# EasyEDA Pro project AnalogPIController_20251124_C.eprj

# Schematic Analog PI Controller v7.1
Board Name: Analog PI Controller v7.1; Create Date: 2025-11-23; Page Name: Schematic; Project Name: AnalogPIController_20251123_a; Schematic Name: Analog PI Controller v7.1; Update Date: 2025-11-23; Add into BOM: yes; Company: Derek Stoddard, Swaroop Handral; Convert to PCB: yes; Date: 2025-11-08; Draw By: Derek Stoddard; REV: 6.0; Sheet: 1/1; spicePre: .
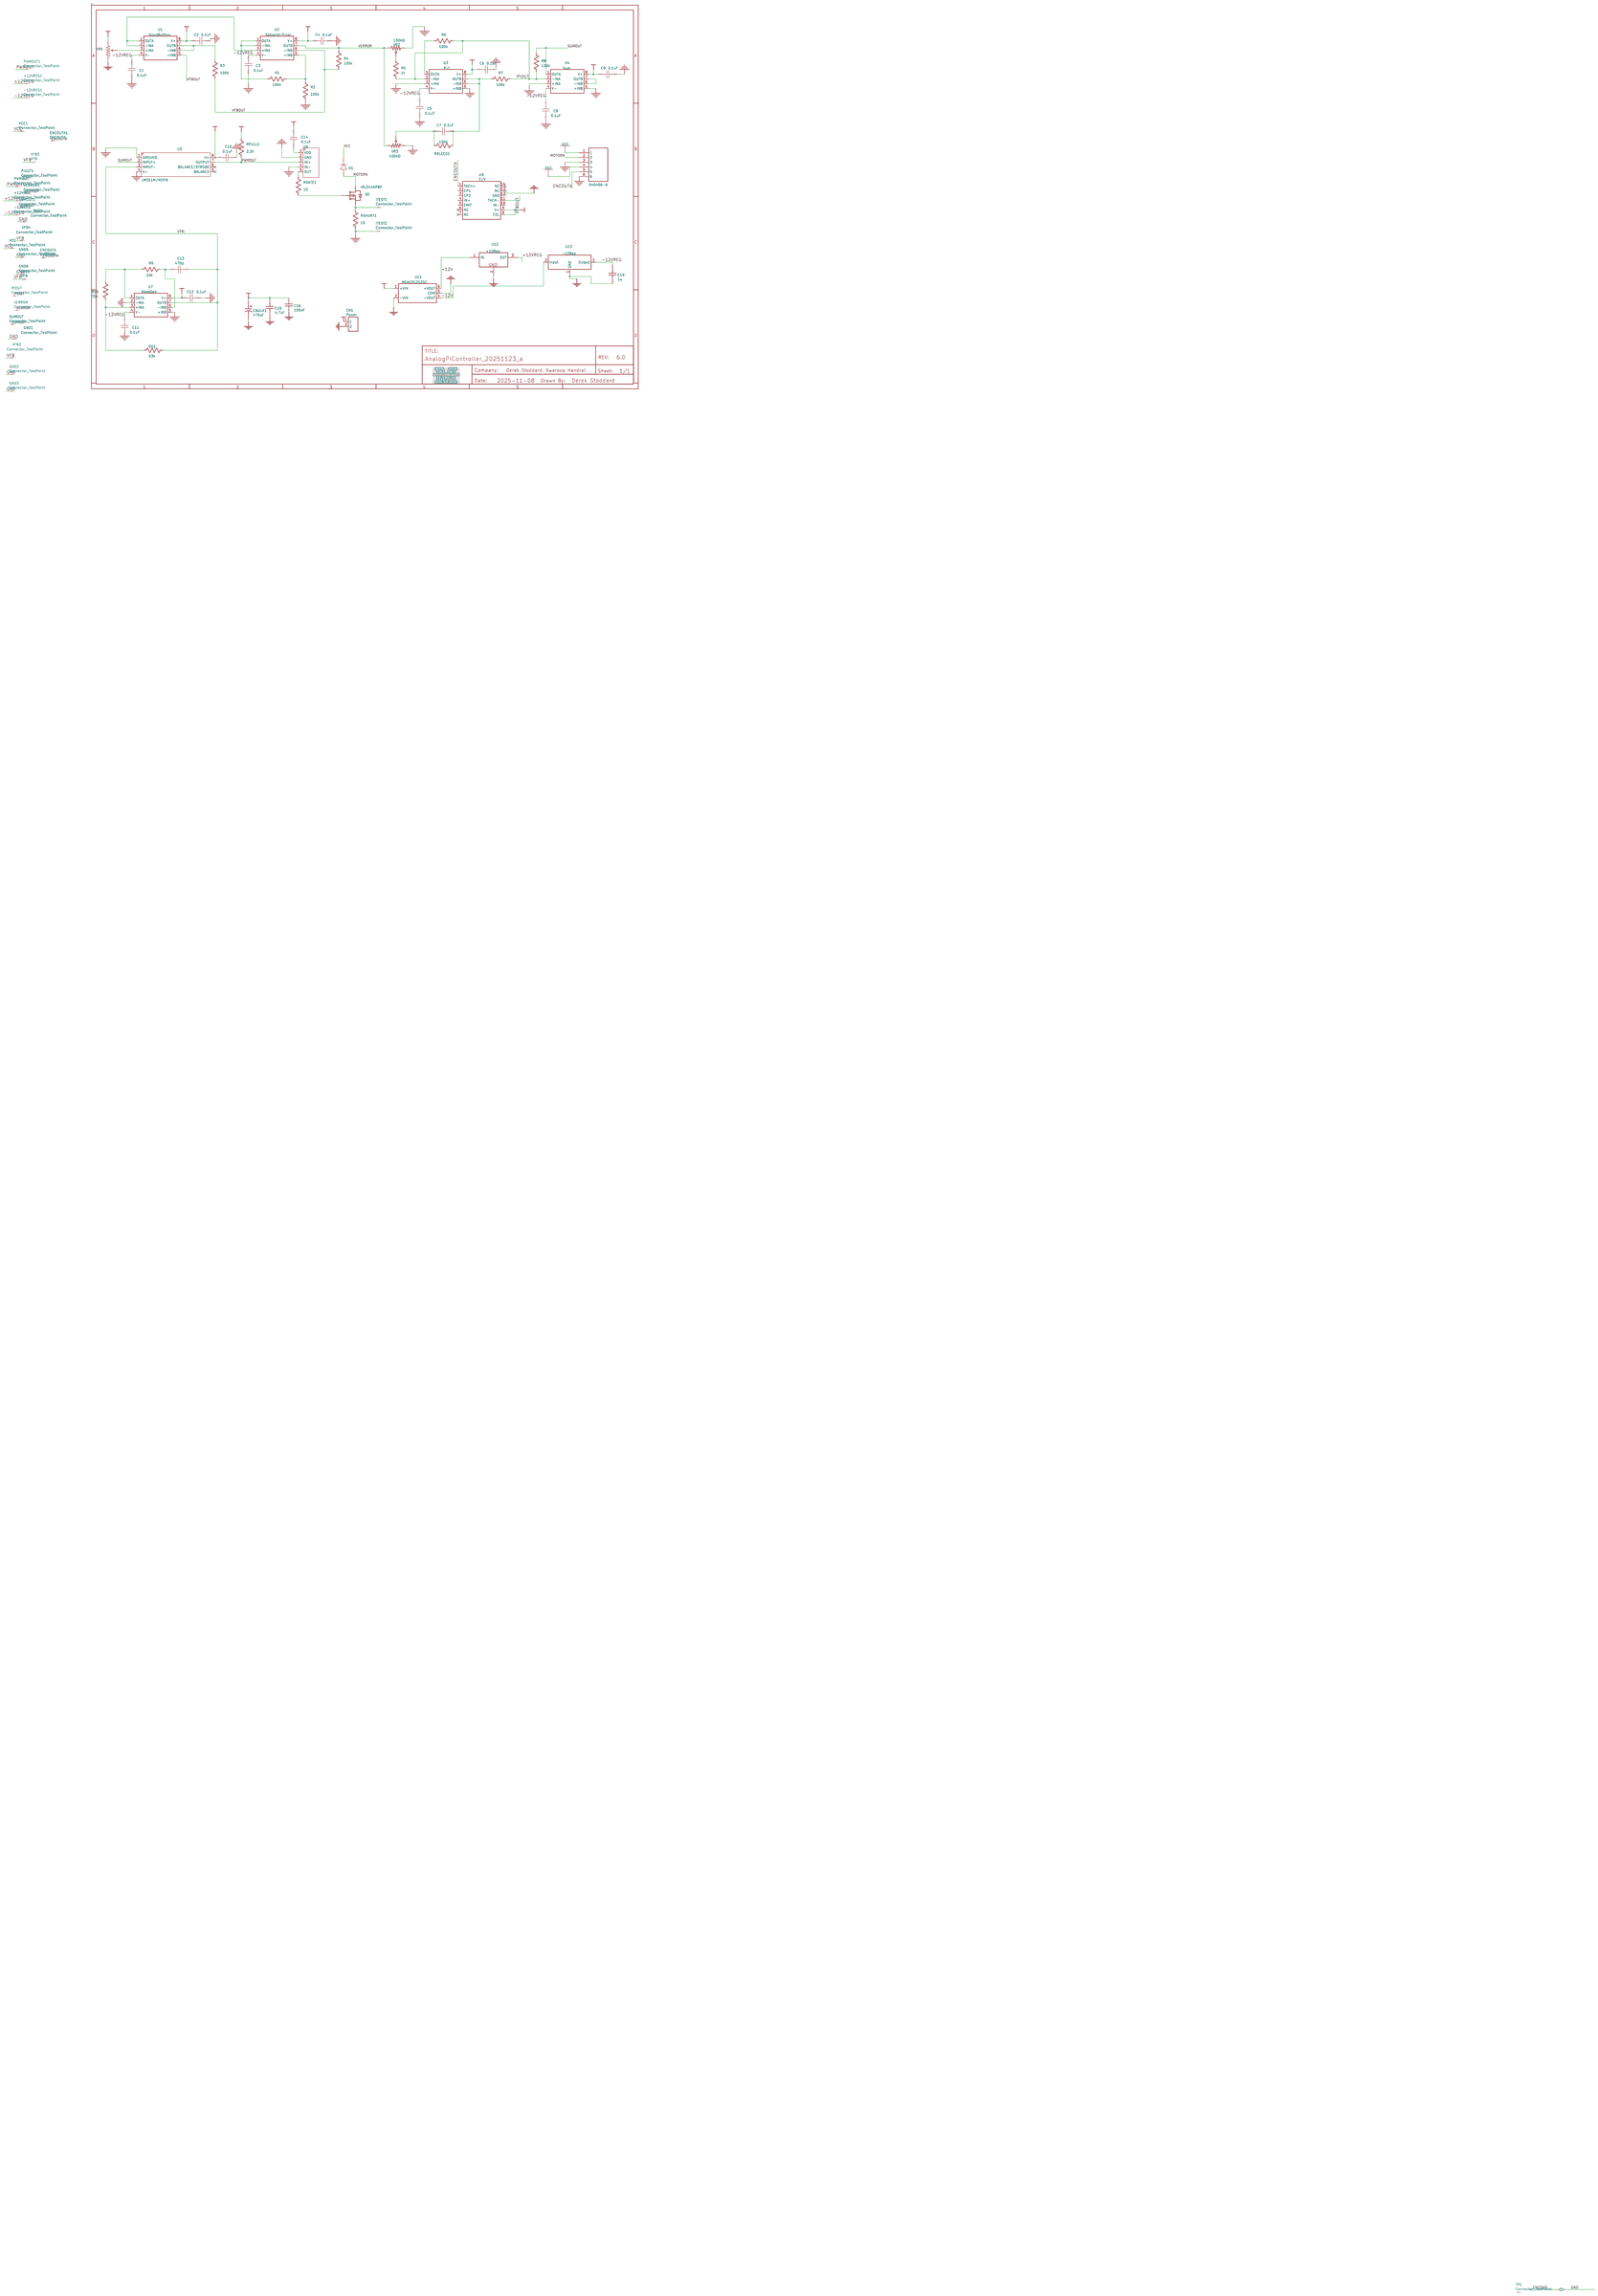
[diagram p0: schematic sheet]

## Parts
+12VREG  Connector_TestPoint  [TESTPOINT:TESTPOINT_PAD_D1.5MM]
+12VREG1  Connector_TestPoint  [TESTPOINT:TESTPOINT_PAD_D1.5MM]
-12VREG  Connector_TestPoint  [TESTPOINT:TESTPOINT_PAD_D1.5MM]
-12VREG1  Connector_TestPoint  [TESTPOINT:TESTPOINT_PAD_D1.5MM]
C1  0.1uF  [C0603]
C2  0.1uF  [C0603]
C3  0.1uF  [C0603]
C4  0.1uF  [C0603]
C5  0.1uF  [C0603]
C6  0.1uF  [C0603]
C7  0.1uF  [C0603]
C8  0.1uF  [C0603]
C9  0.1uF  [C0603]
C10  0.1uF  [C0603]
C11  0.1uF  [C0603]
C12  0.1uF  [C0603]
C13  470p  [C0603]
C14  0.1uF  [C0603]
C15  4.7uF  [C0603]
C16  100nF  [C0603]
C19  1u  [C0603]
CBULK1  470uF  [CAP-SMD_BD10.0-L10.3-W10.3-FD]
CN1  Power  [CONN-TH_2P-P5.00_691137710002]
D1  -  [R-6_BD9.0-L9.0-W9.0-P15.00-D1.7-FD]
ENCOUTA  ENCOUTA  [TESTPOINT:TESTPOINT_PAD_D1.5MM]
ENCOUTA1  ENCOUTA  [TESTPOINT:TESTPOINT_PAD_D1.5MM]
GND1  Connector_TestPoint  [TESTPOINT:TESTPOINT_PAD_D1.5MM]
GND2  Connector_TestPoint  [TESTPOINT:TESTPOINT_PAD_D1.5MM]
GND3  Connector_TestPoint  [TESTPOINT:TESTPOINT_PAD_D1.5MM]
GND4  Connector_TestPoint  [TESTPOINT:TESTPOINT_PAD_D1.5MM]
GND5  Connector_TestPoint  [TESTPOINT:TESTPOINT_PAD_D1.5MM]
GND6  Connector_TestPoint  [TESTPOINT:TESTPOINT_PAD_D1.5MM]
ITEST1  Connector_TestPoint  [TESTPOINT:TESTPOINT_PAD_D1.5MM]
ITEST2  Connector_TestPoint  [TESTPOINT:TESTPOINT_PAD_D1.5MM]
PIOUT  Connector_TestPoint  [TESTPOINT:TESTPOINT_PAD_D1.5MM]
PIOUT1  Connector_TestPoint  [TESTPOINT:TESTPOINT_PAD_D1.5MM]
PWMOUT  Connector_TestPoint  [TESTPOINT:TESTPOINT_PAD_D1.5MM]
PWMOUT1  Connector_TestPoint  [TESTPOINT:TESTPOINT_PAD_D1.5MM]
Q1  IRLZ44NPBF  [TO-220-3_L10.0-W4.5-P2.54-T]
R1  100k  [R0603]
R2  100k  [R0603]
R3  100k  [R0603]
R4  100k  [R0603]
R5  1k  [R0603]
R6  100k  [R0603]
R7  100k  [R0603]
R8  100k  [R0603]
R9  10k  [R0603]
R10  75k  [R0603]
R11  63k  [R0603]
RBLEED1  100k  [R0603]
RGATE1  10  [R0603]
RPULL1  2.2k  [R0603]
RSHUNT1  10  [R0603]
SUMOUT  Connector_TestPoint  [TESTPOINT:TESTPOINT_PAD_D1.5MM]
SUMOUT1  Connector_TestPoint  [TESTPOINT:TESTPOINT_PAD_D1.5MM]
TP1  Connector_TestPoint  [TESTPOINT:TESTPOINT_PAD_D1.5MM]
U1  InputBuffers  [SOIC-8_L4.9-W3.9-P1.27-LS6.0-BL]
U2  Setpoint/Error  [SOIC-8_L4.9-W3.9-P1.27-LS6.0-BL]
U3  P/I  [SOIC-8_L4.9-W3.9-P1.27-LS6.0-BL]
U4  Sum  [SOIC-8_L4.9-W3.9-P1.27-LS6.0-BL]
U5  LM311M/NOPB  [SOIC-8_L4.9-W3.9-P1.27-LS6.0-BL]
U6  -  [SOT-23-5_L3.0-W1.7-P0.95-LS2.8-BR]
U7  WaveGen  [SOIC-8_L4.9-W3.9-P1.27-LS6.0-BL]
U9  F/V  [SOIC-14_L8.7-W3.9-P1.27-LS6.0-BL]
U10  640456-6  [TE_640456-6]
U11  MEA1D1212SC  [PWRM-TH_MEA1DXXXXSC]
U12  +12Reg  [TO-220-3_L10.2-W4.6-P2.54-L]
U13  -12Reg  [TO-220-3_L10.2-W4.6-P2.54-L]
VCC  Connector_TestPoint  [TESTPOINT:TESTPOINT_PAD_D1.5MM]
VCC1  Connector_TestPoint  [TESTPOINT:TESTPOINT_PAD_D1.5MM]
VERROR  Connector_TestPoint  [TESTPOINT:TESTPOINT_PAD_D1.5MM]
VERROR1  Connector_TestPoint  [TESTPOINT:TESTPOINT_PAD_D1.5MM]
VFB1  VFB  [TESTPOINT:TESTPOINT_PAD_D1.5MM]
VFB2  Connector_TestPoint  [TESTPOINT:TESTPOINT_PAD_D1.5MM]
VFB3  VFB  [TESTPOINT:TESTPOINT_PAD_D1.5MM]
VFB4  Connector_TestPoint  [TESTPOINT:TESTPOINT_PAD_D1.5MM]
VR1  RK1631110U2A  [RES-ADJ-TH_RK1631110U2A]
VR2  100kΩ  [RES-ADJ-SMD_L4.8-W3.5-P2.50-BL-1]
VR3  100kΩ  [RES-ADJ-SMD_L4.8-W3.5-P2.50-BL-1]

## Library data of the parts
+12VREG +12VREG1 -12VREG -12VREG1 GND1-GND6 ITEST1 ITEST2 PIOUT PIOUT1 PWMOUT PWMOUT1 SUMOUT SUMOUT1 TP1 VCC VCC1 VERROR VERROR1 VFB2 VFB4 = Connector_TestPoint: Contributor: lolologe; spicePre: T
C1-C14 = CAP_0603: Supplier Footprint: 0603
C15 = 4.7uF: Supplier: LCSC; Supplier Part: C90057; Manufacturer: muRata(村田); Manufacturer Part: GRM188R61E475KE11D; JLCPCB Part Class: Extended Part; nameAlias: Value; Contributor: LCSC; spicePre: C; spiceSymbolName: GRM188R61E475KE11D
C16 = 100nF: Supplier: LCSC; Manufacturer Part: GRM033R61E104KE14D; Manufacturer: muRata(村田); Supplier Part: C76939; JLCPCB Part Class: Extended Part; nameAlias: Value; spicePre: C; spiceSymbolName: GRM033R61E104KE14D
C19 = 1u: nameAlias: Value(F); Contributor: LCEDA_Lib; spicePre: C; spiceSymbolName: C_0603_US
CBULK1 = 470uF: Supplier: LCSC; Supplier Part: C494847; Manufacturer: PANASONIC(松下); Manufacturer Part: EEEFN1V471UP; JLCPCB Part Class: Extended Part; nameAlias: Value; Contributor: lcsc; spicePre: C; spiceSymbolName: EEEFN1V471UP
CN1 = Power: Supplier: LCSC; Supplier Part: C5332011; Manufacturer: Wurth(伍尔特); Manufacturer Part: 691137710002; JLCPCB Part Class: Extended Part; Contributor: lcsc; spicePre: C; spiceSymbolName: 691137710002
D1 = 1N4007: Supplier Footprint: DO-41
ENCOUTA ENCOUTA1 = ENCOUTA: Contributor: lolologe; spicePre: T; spiceSymbolName: Connector_TestPoint
Q1 = IRLZ44NPBF: Supplier: LCSC; Manufacturer: Infineon(英飞凌); Supplier Part: C38774; JLCPCB Part Class: Extended Part; spicePre: Q
R1-R11 RBLEED1 RGATE1 RPULL1 RSHUNT1 = 1k: nameAlias: Value(Ω); Contributor: LCEDA_Lib; spicePre: R; spiceSymbolName: R_0603_US
U1-U4 = Buff/Err: Supplier: LCSC; Supplier Part: C1347222; Manufacturer: TI(德州仪器); Manufacturer Part: OPA2197ID; JLCPCB Part Class: Extended Part; Contributor: LCSC; spicePre: U; spiceSymbolName: OPA2197ID; Package Display: No
U5 = LM311M/NOPB: Input Offset Voltage (Vos):7.5mV Input Bias Current (Ib):250nA Input Hysteresis Voltage (Vhys):- Common Mode Rejection Ratio (CMRR):- Supply Voltage:5V~36V；2.5V~18V Supply Voltage:5V~36V；2.5V~18V Output Type:Open set；Open shoot Output Mode:MOS；RTL；DTL；TTL; Supplier Part: C352842; Manufacturer: TI(德州仪器); Supplier Footprint: SOIC-8; JLCPCB Part Class: Extended Part; Datasheet: https://www.ti.com/cn/lit/gpn/lm311-n; Supplier: LCSC; Input Offset Voltage (Vos): 7.5mV; Input Bias Current (Ib): 250nA; Supply Voltage: 5V~36V；2.5V~18V; Output Type: Open set；Open shoot; Output Mode: MOS；RTL；DTL；TTL; Operating Temperature: 0℃~+70℃
U6 = UCC27517DBVR: Supplier Part: C99395; Manufacturer: TI(德州仪器); Supplier Footprint: SOT-23-5; JLCPCB Part Class: Extended Part; Datasheet: https://atta.szlcsc.com/upload/public/pdf/source/20170518/1495086077196.pdf; Supplier: LCSC
U7 = WaveGen: Supplier: LCSC; Supplier Part: C1347222; Manufacturer: TI(德州仪器); Manufacturer Part: OPA2197ID; JLCPCB Part Class: Extended Part; Contributor: LCSC; spicePre: U; spiceSymbolName: OPA2197ID
U9 = F/V: Supplier: LCSC; Supplier Part: C914112; Manufacturer: TI(德州仪器); Manufacturer Part: LM2917MX/NOPB; JLCPCB Part Class: Extended Part; Contributor: lcsc; spicePre: U; spiceSymbolName: LM2917MX/NOPB
U10 = 640456-6
U11 = MEA1D1212SC: Supplier: LCSC; Supplier Part: C5382235; Manufacturer: YLPTEC(易川); Contributor: lcsc; spicePre: U
U12 = +12Reg: Supplier: LCSC; Supplier Part: C2872599; Manufacturer: TI(德州仪器); Manufacturer Part: LM7812CT/NOPB; JLCPCB Part Class: Extended Part; Contributor: lcsc; spicePre: U; spiceSymbolName: LM7812CT/NOPB
U13 = -12Reg: Supplier: LCSC; Supplier Part: C10116; Manufacturer: TI(德州仪器); Manufacturer Part: LM7912CT/NOPB; JLCPCB Part Class: Extended Part; Contributor: lcsc; spicePre: U; spiceSymbolName: LM7912CT/NOPB
VFB1 VFB3 = VFB: Contributor: lolologe; spicePre: T; spiceSymbolName: Connector_TestPoint
VR1 = RK1631110U2A: LCSC Part Name: RK1631110U2A 三件套; Supplier Part: C3007973; Manufacturer: ALPSALPINE(阿尔卑斯阿尔派); Supplier Footprint: 插件; Datasheet: https://atta.szlcsc.com/upload/public/pdf/source/20220811/DF006DA1C1FC1909BE18ADD0BBA20DF6.pdf; Supplier: LCSC
VR2 VR3 = 100kΩ: Supplier: LCSC; Supplier Part: C7328709; Manufacturer: BOURNS; Manufacturer Part: PVG5A104C03R00; JLCPCB Part Class: Extended Part; nameAlias: Value; Contributor: lcsc; spicePre: R; spiceSymbolName: PVG5A104C03R00

## Nets
+12V: U11.6(+VOUT) U12.1(IN)
+12VREG: +12VREG.1 +12VREG1.1 C2.1 C4.1 C6.1 C9.1 C10.1 C12.1 C14.2 RPULL1.1 U1.8(V+) U2.8(V+) U3.8(V+) U4.8(V+) U5.8(V+) U7.8(V+) U9.8(COL) U9.9(V+) U12.3(OUT) VR1.3
-12V: U11.4(-VOUT) U13.2(Input)
-12VREG: -12VREG.1 -12VREG1.1 C1.1 C3.1 C5.1 C8.1 C11.1 C19.2 U1.4(V-) U2.4(V-) U3.4(V-) U4.4(V-) U7.4(V-) U13.3(Output)
GND: C1.2 C2.2 C3.2 C4.2 C5.2 C6.2 C8.2 C9.2 C10.2 C11.2 C12.2 C15.1 C16.1 C19.1 CBULK1.2 CN1.2 GND1.1 GND2.1 GND3.1 GND4.1 GND5.1 GND6.1 ITEST2.1 R2.2 RSHUNT1.2 U3.3(+INA) U3.5(+INB) U4.3(+INA) U4.5(+INB) U5.1(GROUND) U5.4(V-) U6.2(GND) U6.4(IN-) U7.2(-INA) U7.5(+INB) U9.12(GND) U10.3 U10.6 U11.2(-VIN) U11.5(COM) U12.2(GND) U13.1(GND) VR1.1 VR2.3 VR3.3
VCC: C15.2 C16.2 CBULK1.1 CN1.1 D1.1(K) U10.1 U10.4 U11.1(+VIN) VCC.1 VCC1.1
ENCOUTA: ENCOUTA.1 ENCOUTA1.1 U9.1(TACH+) U10.5
MOTORN: D1.2(A) Q1.2(D) U10.2
PIOUT: PIOUT.1 PIOUT1.1 R5.2 R6.1 R7.1 R8.2 U3.2(-INA) U4.2(-INA)
PWMOUT: PWMOUT.1 PWMOUT1.1 RPULL1.2 U5.7(OUTPUT) U6.3(IN+)
SUMOUT: R8.1 SUMOUT.1 SUMOUT1.1 U4.1(OUTA) U5.2(INPUT+)
VERROR: R4.1 U2.7(OUTB) VERROR.1 VERROR1.1 VR2.1 VR3.1
VFB: VFB1.1 VFB2.1 VFB3.1 VFB4.1
VFBOUT: R3.2 R4.2 U1.5(+INB) U2.6(-INB) U9.11(TACH-)
VTRI: C13.2 R11.1 U5.3(INPUT-) U7.7(OUTB)
Net-(C7-1): C7.1 RBLEED1.2 VR3.2
Net-(C7-2): C7.2 R7.2 RBLEED1.1 U3.6(-INB) U3.7(OUTB)
Net-(C13-1): C13.1 R9.1 U7.6(-INB)
Net-(C14-1): C14.1 U6.1(VDD)
Net-(ITEST1-1): ITEST1.1 Q1.3(S) RSHUNT1.1
Net-(Q1-1): Q1.1(G) RGATE1.2
Net-(R1-1): R1.1 R2.1 U2.5(+INB)
Net-(R1-2): R1.2 U2.1(OUTA) U2.2(-INA)
Net-(R3-1): R3.1 U1.6(-INB) U1.7(OUTB)
Net-(R5-1): R5.1 VR2.2
Net-(R6-2): R6.2 U3.1(OUTA)
Net-(R9-2): R9.2 R10.1 U7.1(OUTA)
Net-(R10-2): R10.2 R11.2 U7.3(+INA)
Net-(RGATE1-1): RGATE1.1 U6.5(OUT)
Net-(U1-1): U1.1(OUTA) U1.2(-INA) U2.3(+INA)
Net-(U1-3): U1.3(+INA) VR1.2
Net-(U4-6): U4.6(-INB) U4.7(OUTB)

Not connected (* = marked no-connect by the designer): TP1 1; U5 5(BALANCE)* 6(BALANCE/STROBE)*; U9 2(CP1) 3(CP2) 4(IN+) 5(EMIT) 6(NC)* 7(NC)* 10(IN-) 13(NC)* 14(NC)*

# Schematic PIControllerv7.5
Board Name: PCB2; Create Date: 2025-11-24; Page Name: Sch_PIControllerv7.5; Project Name: AnalogPIController_20251124_C; Schematic Name: PIControllerv7.5; Update Date: 2025-11-24; Company: University of Maine; Drawn: Derek Stoddard; Page Size: A4; Version: V7.5
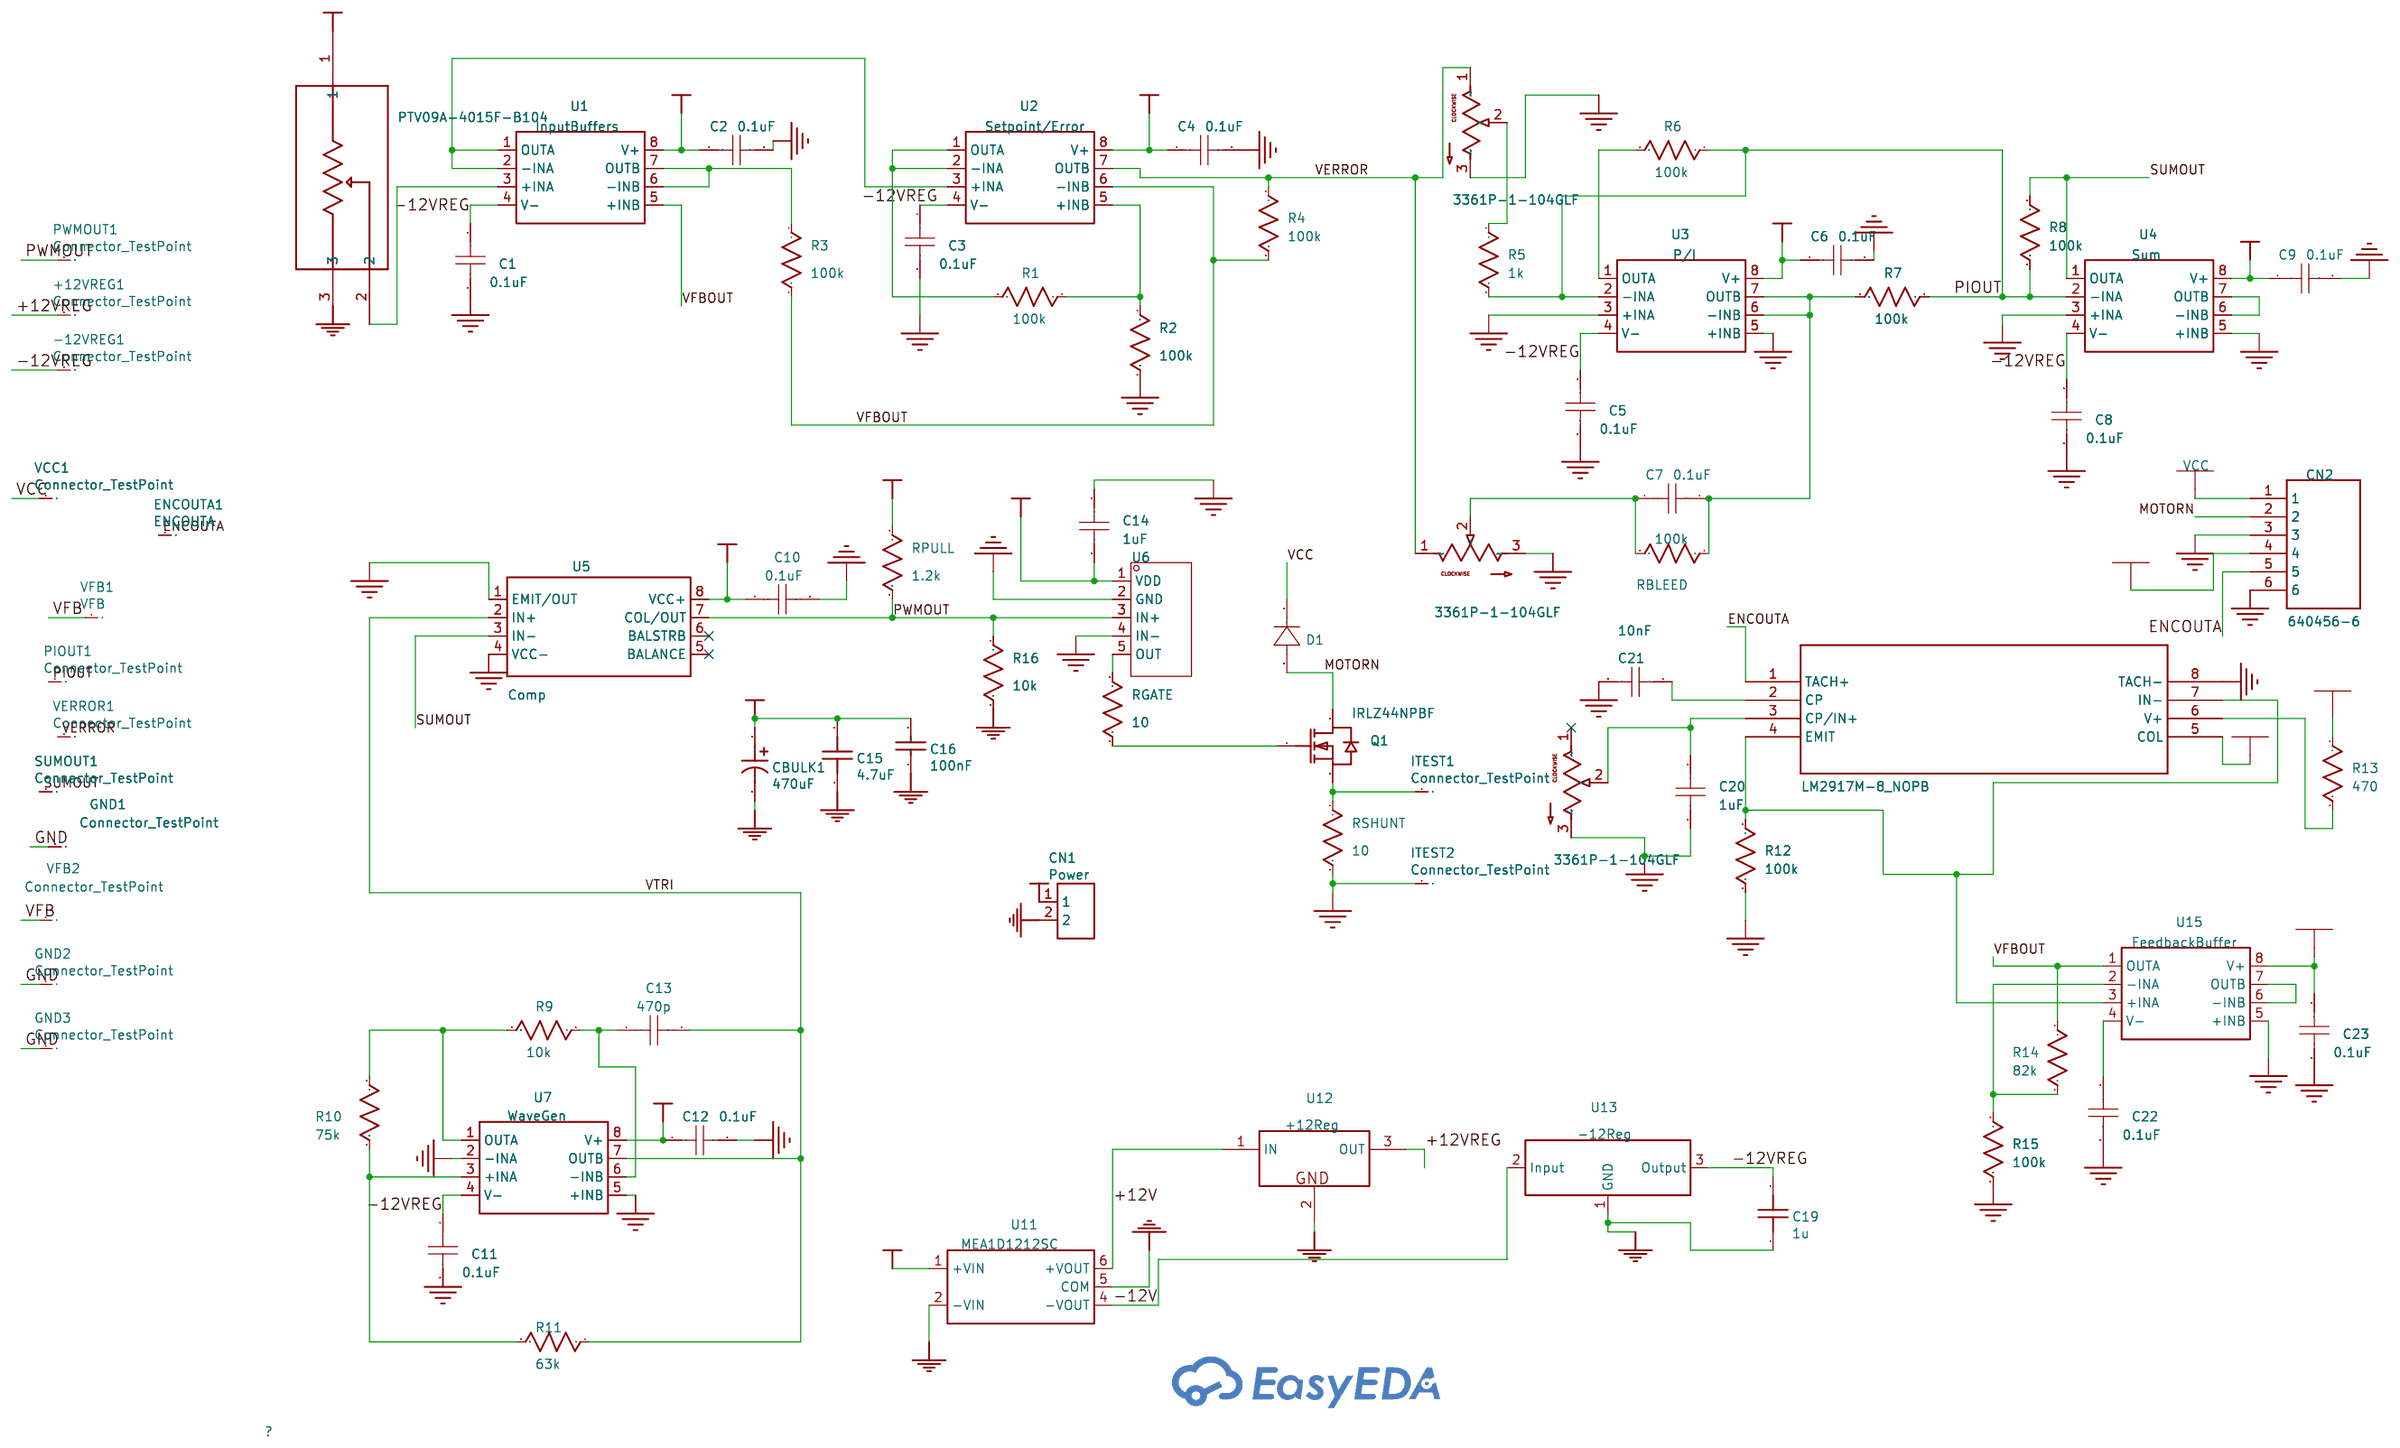
[diagram p1: schematic sheet]

## Parts
+12VREG1  Connector_TestPoint  [TESTPOINT:TESTPOINT_PAD_D1.5MM]
-12VREG1  Connector_TestPoint  [TESTPOINT:TESTPOINT_PAD_D1.5MM]
C1  0.1uF  [C0603]
C2  0.1uF  [C0603]
C3  0.1uF  [C0603]
C4  0.1uF  [C0603]
C5  0.1uF  [C0603]
C6  0.1uF  [C0603]
C7  0.1uF  [C0603]
C8  0.1uF  [C0603]
C9  0.1uF  [C0603]
C10  0.1uF  [C0603]
C11  0.1uF  [C0603]
C12  0.1uF  [C0603]
C13  470p  [C0603]
C14  1uF  [C0603]
C15  4.7uF  [C0603]
C16  100nF  [C0603]
C19  1u  [C0603]
C20  1uF  [C0603]
C21  10nF  [C0603]
C22  0.1uF  [C0603]
C23  0.1uF  [C0603]
CBULK1  470uF  [CAP-SMD_BD10.0-L10.3-W10.3-FD]
CN1  Power  [CONN-TH_2P-P5.00_691137710002]
CN2  640456-6  [TE_640456-6]
D1  -  [R-6_BD9.0-L9.0-W9.0-P15.00-D1.7-FD]
ENCOUTA1  ENCOUTA  [TESTPOINT:TESTPOINT_PAD_D1.5MM]
GND1  Connector_TestPoint  [TESTPOINT:TESTPOINT_PAD_D1.5MM]
GND2  Connector_TestPoint  [TESTPOINT:TESTPOINT_PAD_D1.5MM]
GND3  Connector_TestPoint  [TESTPOINT:TESTPOINT_PAD_D1.5MM]
ITEST1  Connector_TestPoint  [TESTPOINT:TESTPOINT_PAD_D1.5MM]
ITEST2  Connector_TestPoint  [TESTPOINT:TESTPOINT_PAD_D1.5MM]
PIOUT1  Connector_TestPoint  [TESTPOINT:TESTPOINT_PAD_D1.5MM]
PWMOUT1  Connector_TestPoint  [TESTPOINT:TESTPOINT_PAD_D1.5MM]
Q1  IRLZ44NPBF  [TO-220-3_L10.0-W4.5-P2.54-T]
R1  100k  [R0603]
R2  100k  [R0603]
R3  100k  [R0603]
R4  100k  [R0603]
R5  1k  [R0603]
R6  100k  [R0603]
R7  100k  [R0603]
R8  100k  [R0603]
R9  10k  [R0603]
R10  75k  [R0603]
R11  63k  [R0603]
R12  100k  [R0603]
R13  470  [R0603]
R14  82k  [R0603]
R15  100k  [R0603]
R16  10k  [R0603]
RBLEED  100k  [R0603]
RGATE  10  [R0603]
RPULL  1.2k  [R0603]
RSHUNT  10  [R0603]
SUMOUT1  Connector_TestPoint  [TESTPOINT:TESTPOINT_PAD_D1.5MM]
U1  InputBuffers  [SOIC-8_L4.9-W3.9-P1.27-LS6.0-BL]
U2  Setpoint/Error  [SOIC-8_L4.9-W3.9-P1.27-LS6.0-BL]
U3  P/I  [SOIC-8_L4.9-W3.9-P1.27-LS6.0-BL]
U4  Sum  [SOIC-8_L4.9-W3.9-P1.27-LS6.0-BL]
U5  Comp  [SOIC-8_L5.0-W4.0-P1.27-LS6.0-BL]
U6  -  [SOT-23-5_L3.0-W1.7-P0.95-LS2.8-BR]
U7  WaveGen  [SOIC-8_L4.9-W3.9-P1.27-LS6.0-BL]
U11  MEA1D1212SC  [PWRM-TH_MEA1DXXXXSC]
U12  +12Reg  [TO-220-3_L10.2-W4.6-P2.54-L]
U13  -12Reg  [TO-220-3_L10.2-W4.6-P2.54-L]
U14  LM2917M-8_NOPB  [M08A_TEX]
U15  FeedbackBuffer  [SOIC-8_L4.9-W3.9-P1.27-LS6.0-BL]
VCC1  Connector_TestPoint  [TESTPOINT:TESTPOINT_PAD_D1.5MM]
VERROR1  Connector_TestPoint  [TESTPOINT:TESTPOINT_PAD_D1.5MM]
VFB1  VFB  [TESTPOINT:TESTPOINT_PAD_D1.5MM]
VFB2  Connector_TestPoint  [TESTPOINT:TESTPOINT_PAD_D1.5MM]
VR1  PTV09A-4015F-B104  [PTV09A-4015F-B104_BRN]
VR2  3361P-1-104GLF  [TRIM_3361P-1-104GLF]
VR3  3361P-1-104GLF  [TRIM_3361P-1-104GLF]
VR4  3361P-1-104GLF  [TRIM_3361P-1-104GLF]

## Library data of the parts
+12VREG1 -12VREG1 GND1-GND3 ITEST1 ITEST2 PIOUT1 PWMOUT1 SUMOUT1 VCC1 VERROR1 VFB2 = Connector_TestPoint: Contributor: lolologe; spicePre: T
C1-C14 C20-C23 = CAP_0603: Supplier Footprint: 0603
C15 = 4.7uF: Supplier: LCSC; Supplier Part: C90057; Manufacturer: muRata(村田); Manufacturer Part: GRM188R61E475KE11D; JLCPCB Part Class: Extended Part; nameAlias: Value; Contributor: LCSC; spicePre: C; spiceSymbolName: GRM188R61E475KE11D
C16 = 100nF: Supplier: LCSC; Manufacturer Part: GRM033R61E104KE14D; Manufacturer: muRata(村田); Supplier Part: C76939; JLCPCB Part Class: Extended Part; nameAlias: Value; spicePre: C; spiceSymbolName: GRM033R61E104KE14D
C19 = 1u: nameAlias: Value(F); Contributor: LCEDA_Lib; spicePre: C; spiceSymbolName: C_0603_US
CBULK1 = 470uF: Supplier: LCSC; Supplier Part: C494847; Manufacturer: PANASONIC(松下); Manufacturer Part: EEEFN1V471UP; JLCPCB Part Class: Extended Part; nameAlias: Value; Contributor: lcsc; spicePre: C; spiceSymbolName: EEEFN1V471UP
CN1 = Power: Supplier: LCSC; Supplier Part: C5332011; Manufacturer: Wurth(伍尔特); Manufacturer Part: 691137710002; JLCPCB Part Class: Extended Part; Contributor: lcsc; spicePre: C; spiceSymbolName: 691137710002
CN2 = 640456-6
D1 = 1N4007: Supplier Footprint: DO-41
ENCOUTA1 = ENCOUTA: Contributor: lolologe; spicePre: T; spiceSymbolName: Connector_TestPoint
Q1 = IRLZ44NPBF: Supplier: LCSC; Manufacturer: Infineon(英飞凌); Supplier Part: C38774; JLCPCB Part Class: Extended Part; spicePre: Q
R1-R16 RBLEED RGATE RPULL RSHUNT = 1k: nameAlias: Value(Ω); Contributor: LCEDA_Lib; spicePre: R; spiceSymbolName: R_0603_US
U1-U4 U15 = Buff/Err: Supplier: LCSC; Supplier Part: C1347222; Manufacturer: TI(德州仪器); Manufacturer Part: OPA2197ID; JLCPCB Part Class: Extended Part; Contributor: LCSC; spicePre: U; spiceSymbolName: OPA2197ID; Package Display: No
U5 = Comp: Supplier: LCSC; Manufacturer: TI(德州仪器); Manufacturer Part: LM311DR; Supplier Part: C12597; JLCPCB Part Class: Extended Part
U6 = UCC27517DBVR: Supplier Part: C99395; Manufacturer: TI(德州仪器); Supplier Footprint: SOT-23-5; JLCPCB Part Class: Extended Part; Datasheet: https://atta.szlcsc.com/upload/public/pdf/source/20170518/1495086077196.pdf; Supplier: LCSC
U7 = WaveGen: Supplier: LCSC; Supplier Part: C1347222; Manufacturer: TI(德州仪器); Manufacturer Part: OPA2197ID; JLCPCB Part Class: Extended Part; Contributor: LCSC; spicePre: U; spiceSymbolName: OPA2197ID
U11 = MEA1D1212SC: Supplier: LCSC; Supplier Part: C5382235; Manufacturer: YLPTEC(易川); Contributor: lcsc; spicePre: U
U12 = +12Reg: Supplier: LCSC; Supplier Part: C2872599; Manufacturer: TI(德州仪器); Manufacturer Part: LM7812CT/NOPB; JLCPCB Part Class: Extended Part; Contributor: lcsc; spicePre: U; spiceSymbolName: LM7812CT/NOPB
U13 = -12Reg: Supplier: LCSC; Supplier Part: C10116; Manufacturer: TI(德州仪器); Manufacturer Part: LM7912CT/NOPB; JLCPCB Part Class: Extended Part; Contributor: lcsc; spicePre: U; spiceSymbolName: LM7912CT/NOPB
U14 = LM2917M-8_NOPB
VFB1 = VFB: Contributor: lolologe; spicePre: T; spiceSymbolName: Connector_TestPoint
VR1 = PTV09A-4015F-B104
VR2-VR4 = 3361P-1-104GLF

## Nets
+12V: U11.6(+VOUT) U12.1(IN)
+12VREG: +12VREG1.1 C2.1 C4.1 C6.1 C9.1 C10.1 C12.1 C14.1 C23.1 R13.1 RPULL.1 U1.8(V+) U2.8(V+) U3.8(V+) U4.8(V+) U5.8(VCC+) U6.1(VDD) U7.8(V+) U12.3(OUT) U14.5(COL) U15.8(V+) VR1.1
-12V: U11.4(-VOUT) U13.2(Input)
-12VREG: -12VREG1.1 C1.1 C3.1 C5.1 C8.1 C11.1 C19.2 U1.4(V-) U2.4(V-) U3.4(V-) U4.4(V-) U7.4(V-) U13.3(Output)
GND: C1.2 C2.2 C3.2 C4.2 C5.2 C6.2 C8.2 C9.2 C10.2 C11.2 C12.2 C14.2 C15.1 C16.1 C19.1 C20.2 C21.2 C22.2 C23.2 CBULK1.2 CN1.2 CN2.3 CN2.6 GND1.1 GND2.1 GND3.1 ITEST2.1 R2.2 R12.2 R15.2 R16.2 RSHUNT.2 U3.3(+INA) U3.5(+INB) U4.3(+INA) U4.5(+INB) U5.1(EMIT/OUT) U5.4(VCC-) U6.2(GND) U6.4(IN-) U7.2(-INA) U7.5(+INB) U11.2(-VIN) U11.5(COM) U12.2(GND) U13.1(GND) U14.8(TACH-) U15.5(+INB) VR1.3 VR2.3 VR3.3 VR4.3
VCC: C15.2 C16.2 CBULK1.1 CN1.1 CN2.1 CN2.4 D1.1(K) U11.1(+VIN) VCC1.1
ENCOUTA: CN2.5 ENCOUTA1.1 U14.1(TACH+)
MOTORN: CN2.2 D1.2(A) Q1.2(D)
PIOUT: PIOUT1.1 R5.2 R6.1 R7.1 R8.2 U3.2(-INA) U4.2(-INA)
PWMOUT: PWMOUT1.1 R16.1 RPULL.2 U5.7(COL/OUT) U6.3(IN+)
SUMOUT: R8.1 SUMOUT1.1 U4.1(OUTA) U5.3(IN-)
VERROR: R4.1 U2.7(OUTB) VERROR1.1 VR2.1 VR3.1
VFB: VFB1.1 VFB2.1
VFBOUT: R3.2 R4.2 R14.1 U1.5(+INB) U2.6(-INB) U15.1(OUTA)
VTRI: C13.2 R11.1 U5.2(IN+) U7.7(OUTB)
$1N167: U1.3(+INA) VR1.2
$1N171: U1.1(OUTA) U1.2(-INA) U2.3(+INA)
$1N384: R3.1 U1.6(-INB) U1.7(OUTB)
$1N456: R1.2 U2.1(OUTA) U2.2(-INA)
$1N582: R1.1 R2.1 U2.5(+INB)
$1N1238: R6.2 U3.1(OUTA)
$1N1340: C7.2 R7.2 RBLEED.1 U3.6(-INB) U3.7(OUTB)
$1N1453: C7.1 RBLEED.2 VR3.2
$1N1990: U4.6(-INB) U4.7(OUTB)
$1N2500: R9.2 R10.1 U7.1(OUTA)
$1N2518: R10.2 R11.2 U7.3(+INA)
$1N2538: C13.1 R9.1 U7.6(-INB)
$1N2753: RGATE.1 U6.5(OUT)
$1N2757: Q1.1(G) RGATE.2
$1N8807: ITEST1.1 Q1.3(S) RSHUNT.1
$1N11755: C21.1 U14.2(CP)
$1N11930: C20.1 U14.3(CP/IN+) VR4.2
$1N12022: R12.1 U14.4(EMIT) U14.7(IN-) U15.3(+INA)
$1N12302: R13.2 U14.6(V+)
$1N12460: R14.2 R15.1 U15.2(-INA)
$1N13733: C22.1 U15.4(V-)
$1N13815: U15.6(-INB) U15.7(OUTB)
$1N14002: R5.1 VR2.2

Not connected (* = marked no-connect by the designer): U5 5(BALANCE)* 6(BALSTRB)*; VR4 1*

# Board PCB_PCB_Analog-PI-Controller-v7.1_2025-11-15
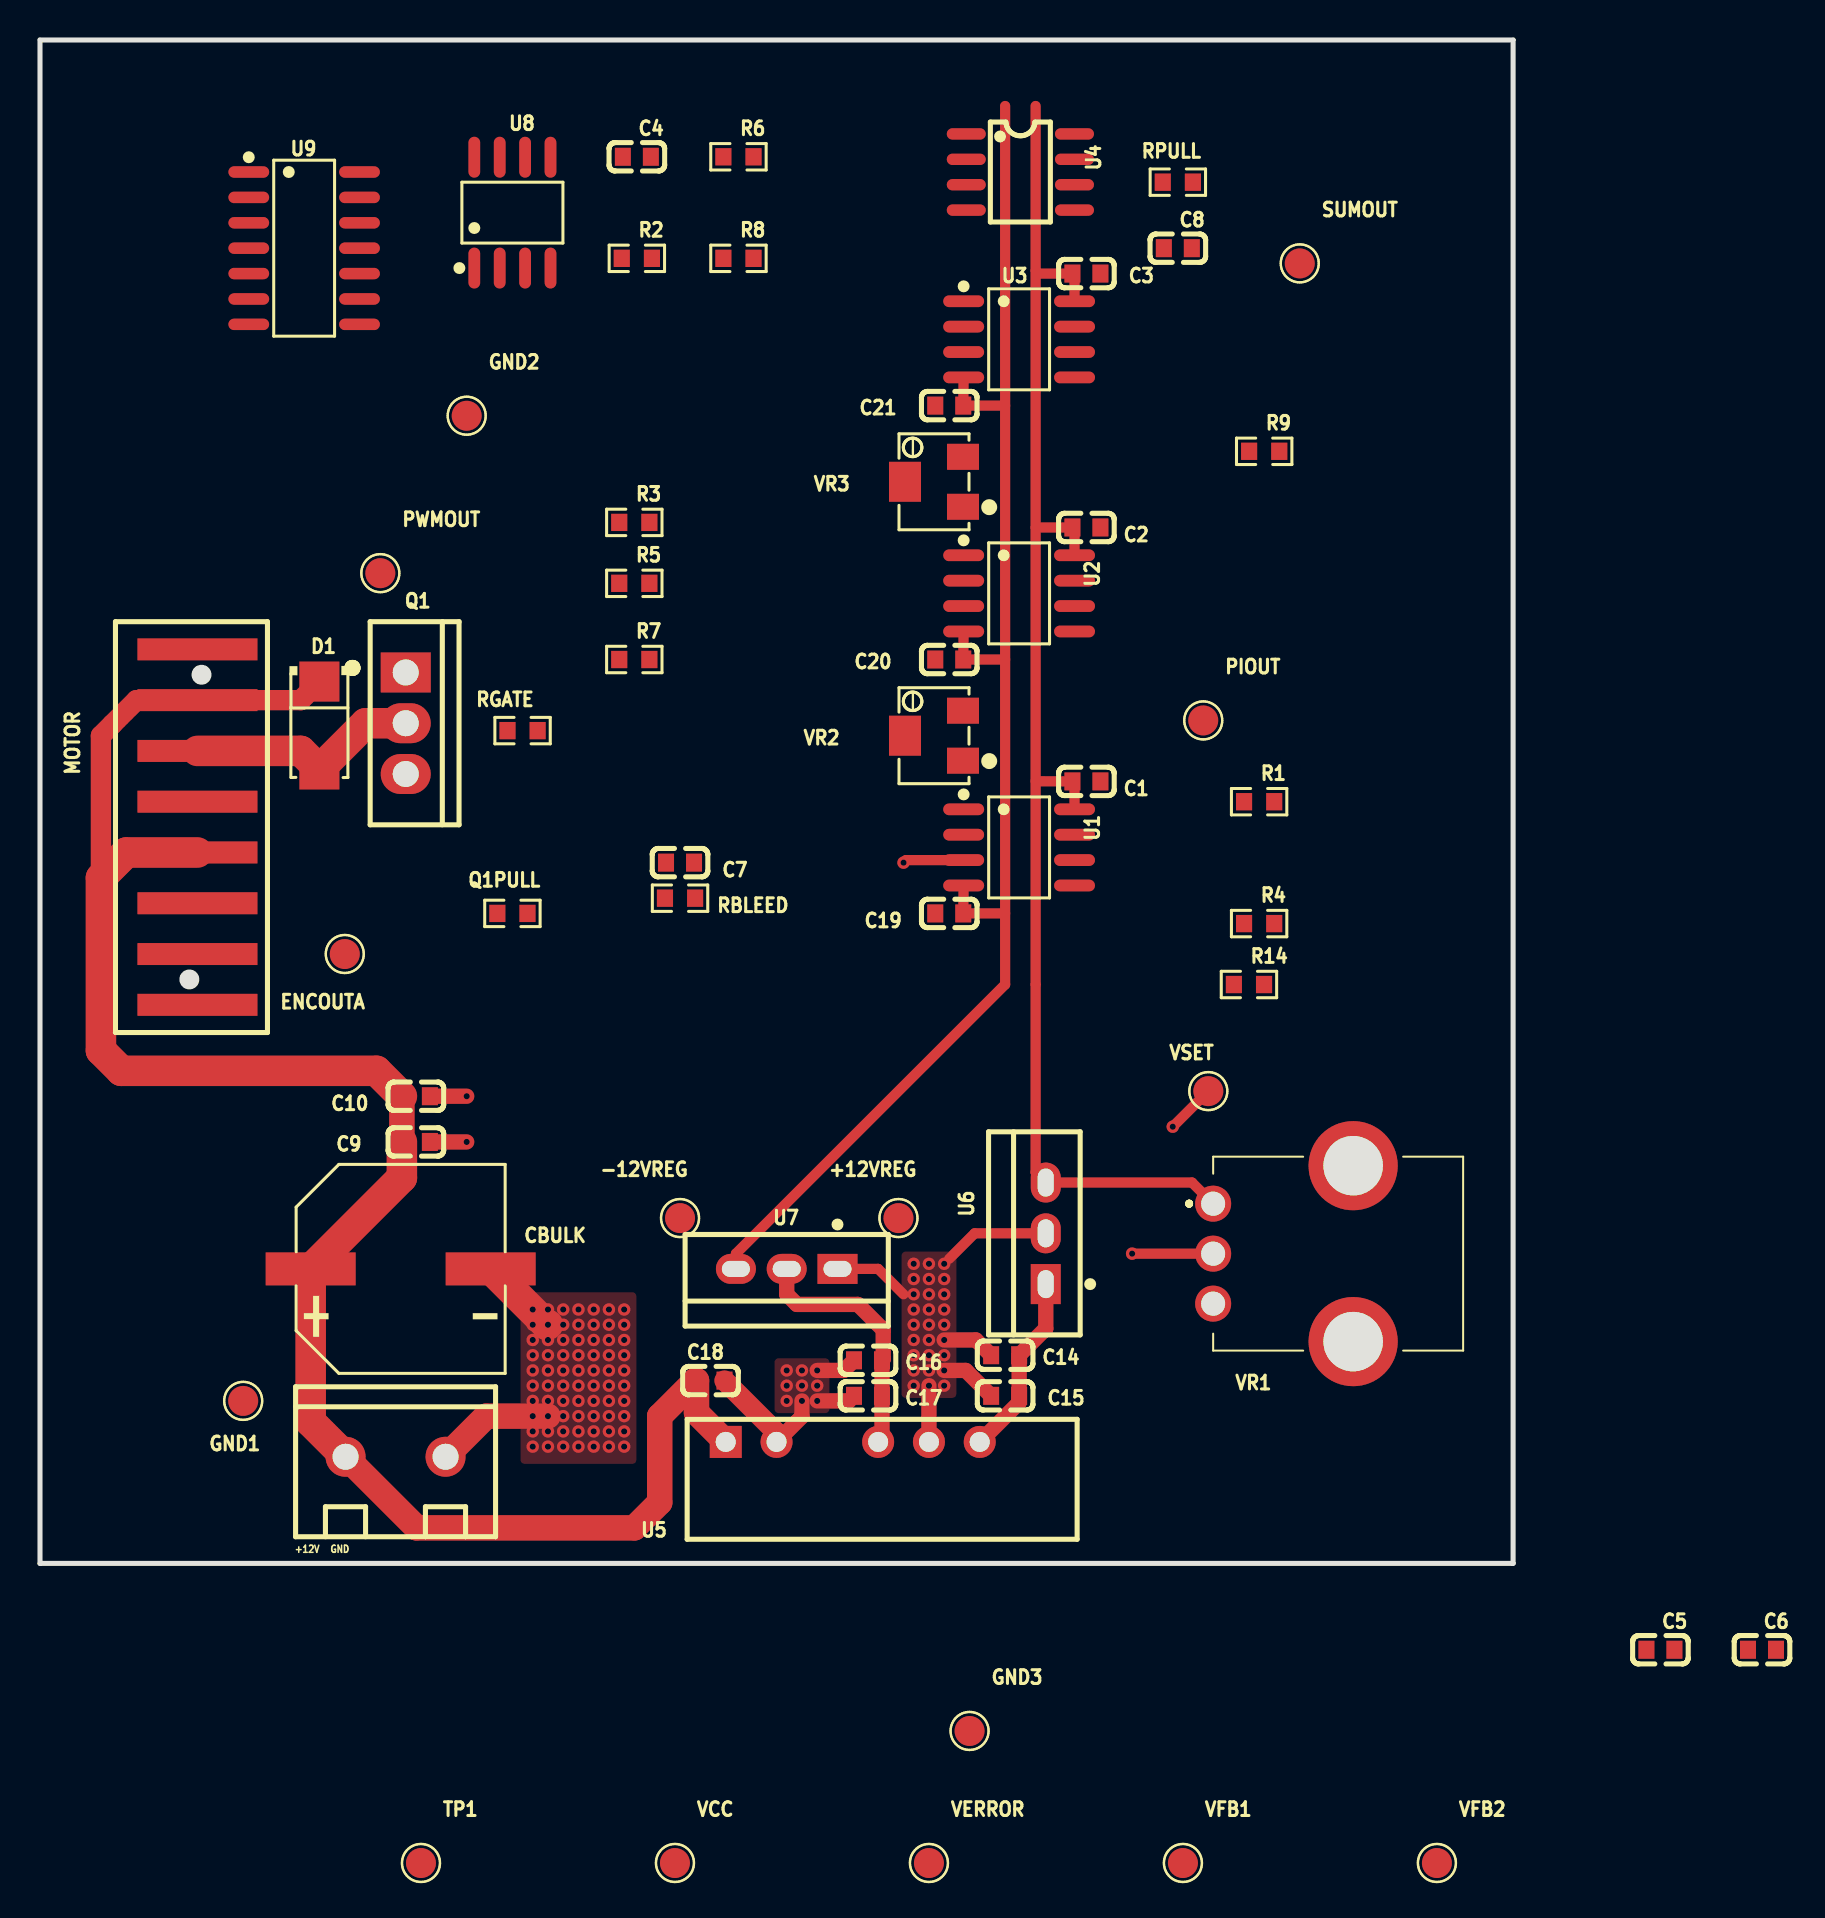
[diagram p2: board, top side]
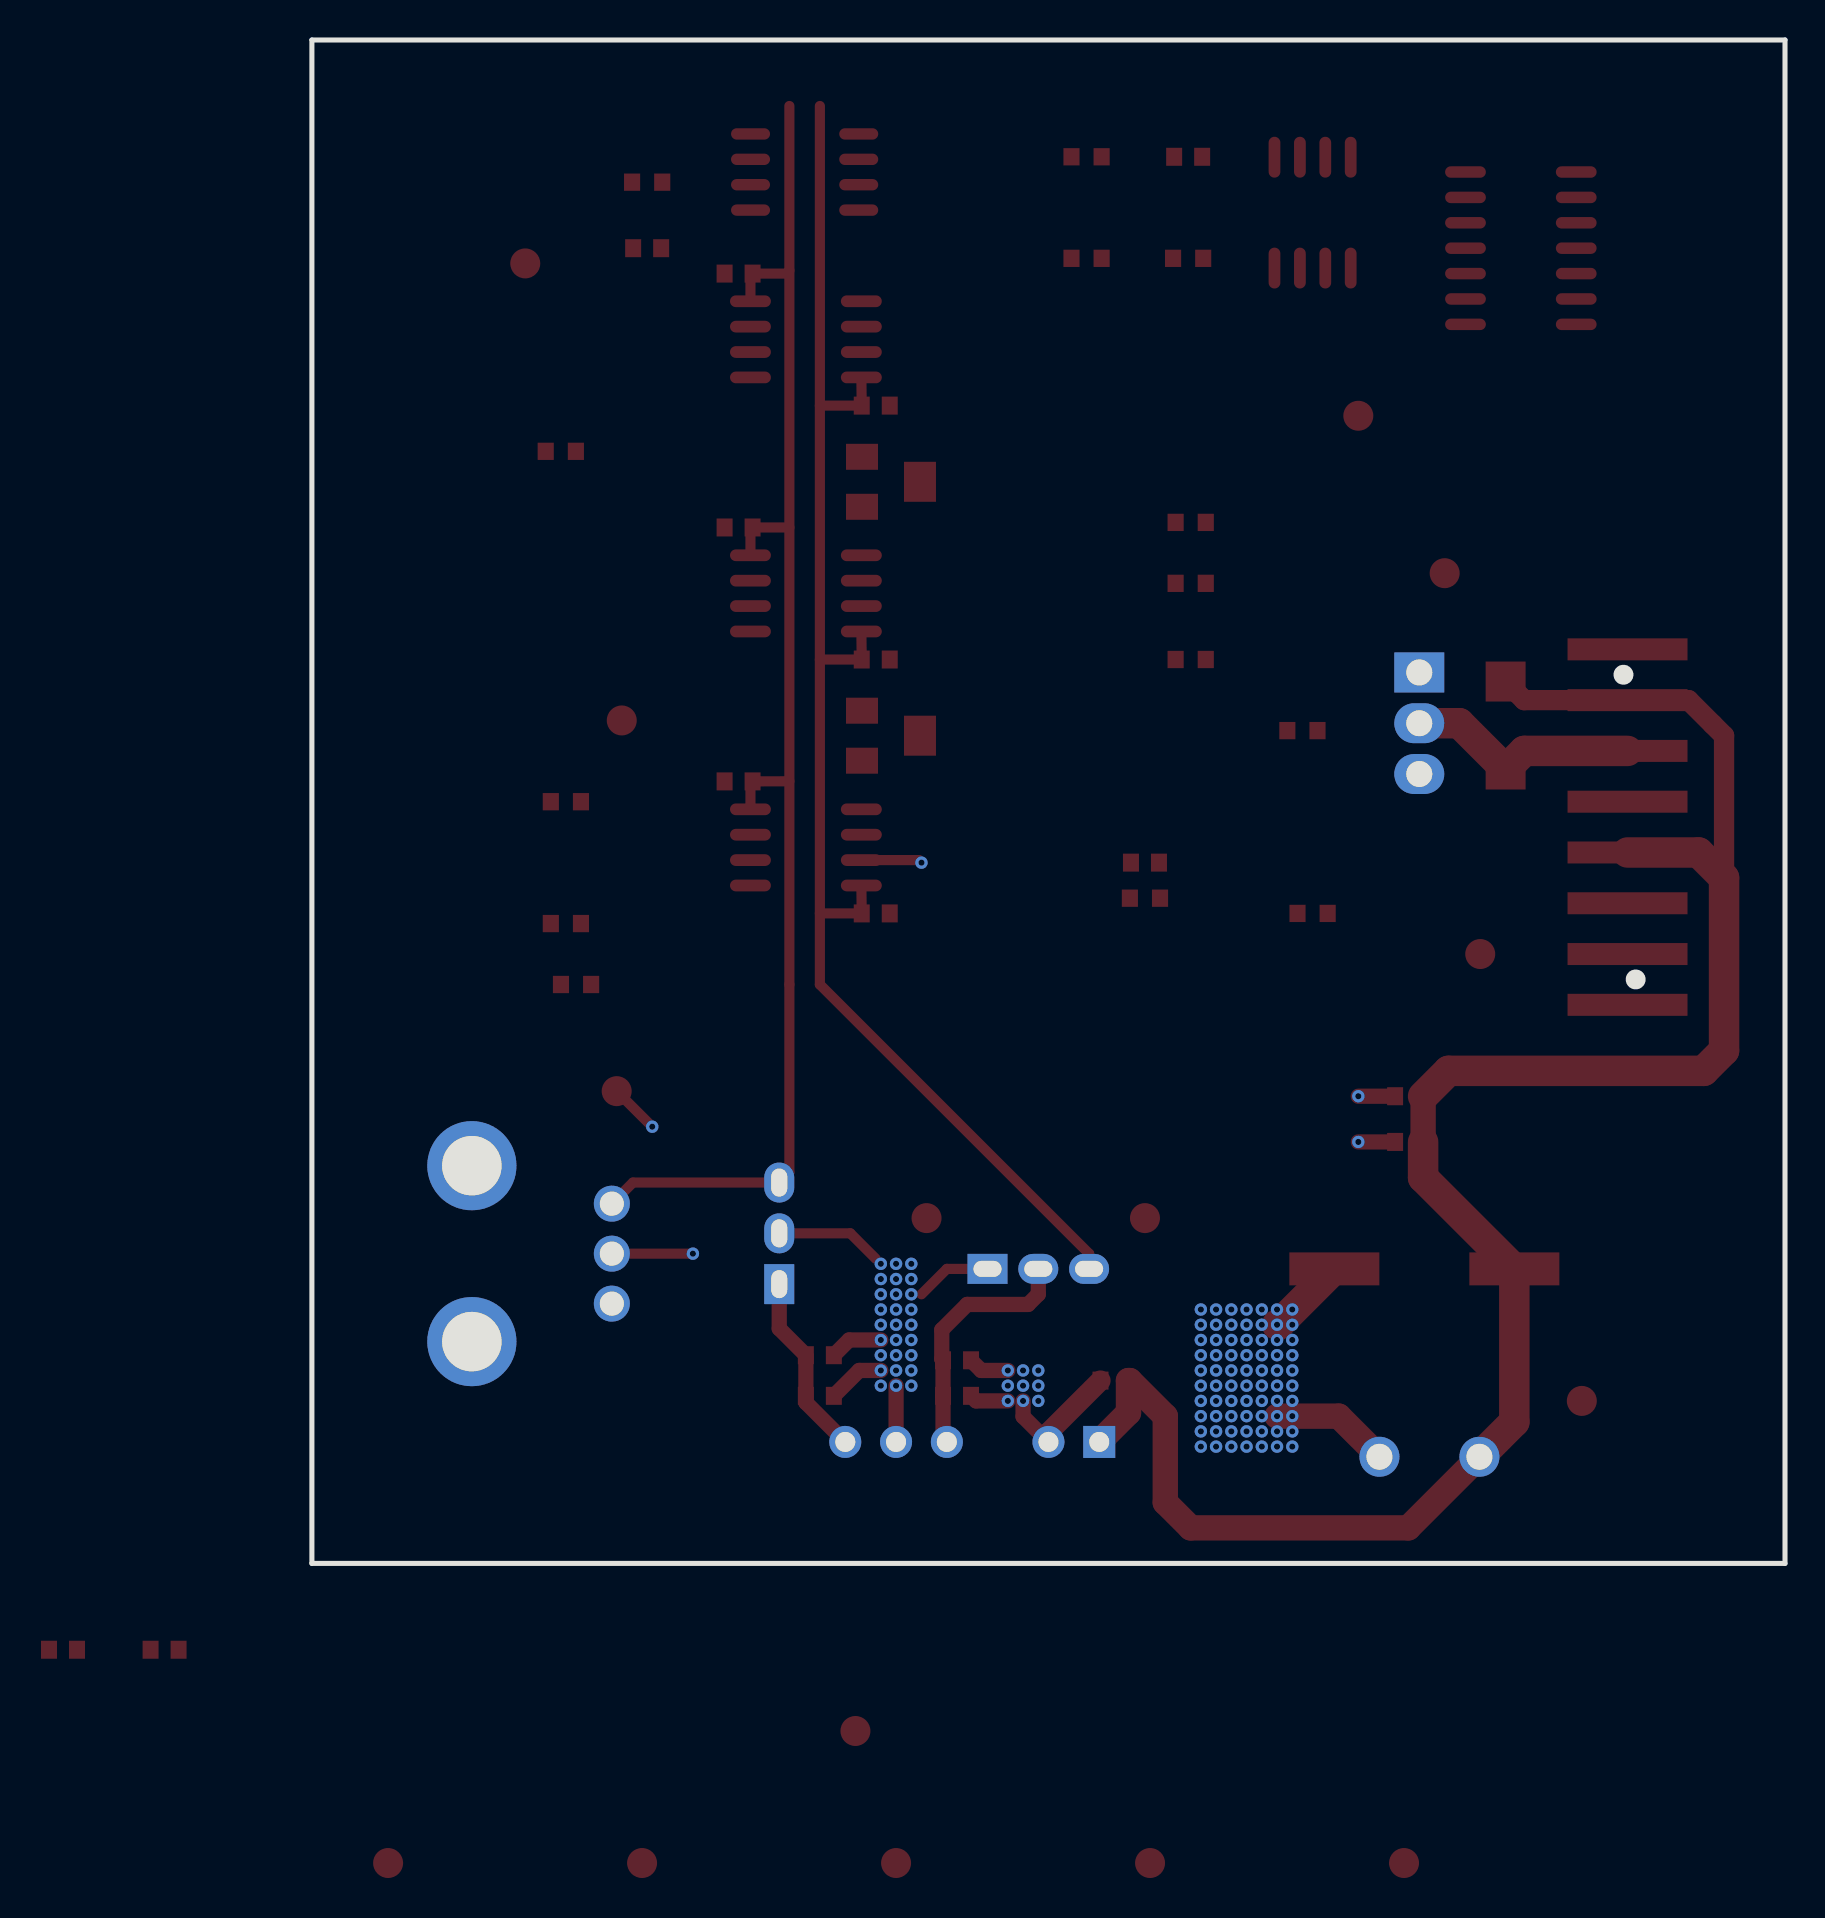
[diagram p3: board, bottom side, seen from below]

Outline 73.66 x 76.2 mm; copper layers: Top Layer, Inner1, Inner2, Bottom Layer. Coordinates in mm from the lower left corner of the outline.
Outline path: 0,76.2 73.66,76.2 73.66,0 0,0 0,76.2
Stack: Top Layer 0.035mm / Dielectric1 0.48mm PP er 4.5 / Inner1 0.035mm / Dielectric2 0.48mm FR4 er 4.5 / Inner2 0.035mm / Dielectric3 0.48mm PP er 4.5 / Bottom Layer 0.035mm

## Design rules (mm)
spacing Default (default): track to track 0.152, other pairs 0 to 0.152
track width Default (default): min 0.254, default 0.254, max 25.4
differential pair differentialPair (default): width min 0.127, default 0.254, max 2.54; gap min 0.152, default 0.152
via Default (default): diameter min 0.61, default 0.61, max 100.025; hole min 0.305, default 0.305, max 59.995
pour e9 uses gge8964
pour e11 uses gge12270
pour e107 uses gge12592
pour e109 uses gge15217
pour e111 uses gge15667

## Placement (name value [footprint] x y rotation side)
+12VREG  Connector_TestPoint  [TESTPOINT:TESTPOINT_PAD_D1.5MM]  42.93 17.27 0 top
-12VREG  Connector_TestPoint  [TESTPOINT:TESTPOINT_PAD_D1.5MM]  32 17.27 0 top
C1  0.1uF  [C0603]  52.32 39.12 0 top
C2  0.1uF  [C0603]  52.32 51.82 0 top
C3  0.1uF  [C0603]  52.32 64.52 0 top
C4  0.1uF  [C0603]  29.84 70.36 0 top
C5  0.1uF  [C0603]  81.03 -4.32 0 top
C6  0.1uF  [C0603]  86.11 -4.32 0 top
C7  0.1uF  [C0603]  32 35.05 0 top
C8  0.1uF  [C0603]  56.9 65.79 0 top
C9  0.1uF  [C0603]  18.8 21.08 180 top
C10  0.1uF  [C0603]  18.8 23.37 180 top
C14  0.1uF  [C0603]  48.26 10.41 0 top
C15  4.7uF  [C0603]  48.26 8.38 0 top
C16  100nF  [C0603]  41.4 10.16 0 top
C17  0.1u  [C0603]  41.4 8.38 0 top
C18  0.1u  [C0603]  33.53 9.14 180 top
C19  1u  [C0603]  45.47 32.51 0 top
C20  0.1u  [C0603]  45.47 45.21 0 top
C21  0.1u  [C0603]  45.47 57.91 0 top
CBULK  470uF  [CAP-SMD_BD10.0-L10.3-W10.3-FD]  18.03 14.73 0 top
CN1  Power  [CONN-TH_2P-P5.00_691137710002]  17.78 5.33 0 top
D1  SK36A  [SMA_L4.3-W2.6-LS5.2-RD]  13.97 41.91 270 top
ENCOUTA  ENCOUTA  [TESTPOINT:TESTPOINT_PAD_D1.5MM]  15.24 30.48 0 top
GND1  Connector_TestPoint  [TESTPOINT:TESTPOINT_PAD_D1.5MM]  10.16 8.13 0 top
GND2  Connector_TestPoint  [TESTPOINT:TESTPOINT_PAD_D1.5MM]  21.34 57.4 0 top
GND3  Connector_TestPoint  [TESTPOINT:TESTPOINT_PAD_D1.5MM]  46.48 -8.38 0 top
MOTOR  MotorConn  [CONN-SMD_6P-P2.54_14110613002000]  7.87 36.83 270 top
PIOUT  Connector_TestPoint  [TESTPOINT:TESTPOINT_PAD_D1.5MM]  58.17 42.16 0 top
PWMOUT  Connector_TestPoint  [TESTPOINT:TESTPOINT_PAD_D1.5MM]  17.02 49.53 0 top
Q1  IRLZ44NPBF  [TO-220-3_L10.0-W4.5-P2.54-T]  18.29 42.03 0 top
Q1PULL  100k  [R0603]  23.62 32.51 0 top
R1  100k  [R0603]  60.96 38.1 0 top
R2  100k  [R0603]  29.84 65.28 0 top
R3  100k  [R0603]  29.72 52.07 0 top
R4  100k  [R0603]  60.96 32 0 top
R5  1k  [R0603]  29.72 49.02 0 top
R6  100k  [R0603]  34.92 70.36 0 top
R7  100k  [R0603]  29.72 45.21 0 top
R8  100k  [R0603]  34.92 65.28 0 top
R9  10k  [R0603]  61.21 55.63 0 top
R14  1k  [R0603]  60.45 28.96 0 top
RBLEED  1k  [R0603]  32 33.27 0 top
RGATE  100  [R0603]  24.13 41.66 0 top
RPULL  20k  [R0603]  56.9 69.09 0 top
SUMOUT  Connector_TestPoint  [TESTPOINT:TESTPOINT_PAD_D1.5MM]  62.99 65.02 0 top
TP1  Connector_TestPoint  [TESTPOINT:TESTPOINT_PAD_D1.5MM]  19.05 -14.99 0 top
U1  InputBuffers  [SOIC-8_L4.9-W3.9-P1.27-LS6.0-BL]  48.96 35.81 270 top
U2  Setpoint/Error  [SOIC-8_L4.9-W3.9-P1.27-LS6.0-BL]  48.96 48.52 270 top
U3  P/I  [SOIC-8_L4.9-W3.9-P1.27-LS6.0-BL]  48.96 61.23 270 top
U4  Sum  [SOIC-8_L5.0-W4.0-P1.27-LS6.0-BL]  49.02 69.6 270 top
U5  LM311M/NOPB  [PWRM-TH_MEA1DXXXXSC]  40.64 6.08 0 top
U6  +12Reg  [TO-220-3_L10.2-W4.6-P2.54-L]  50.29 16.51 90 top
U7  WaveGen  [TO-220-3_L10.2-W4.6-P2.54-L]  37.34 14.73 180 top
U8  WaveGen  [SOIC-8_L4.9-W3.9-P1.27-LS6.0-BL]  23.62 67.56 0 top
U9  F/V  [SOIC-14_L8.7-W3.9-P1.27-LS6.0-BL]  13.21 65.79 270 top
VCC  Connector_TestPoint  [TESTPOINT:TESTPOINT_PAD_D1.5MM]  31.75 -14.99 0 top
VERROR  Connector_TestPoint  [TESTPOINT:TESTPOINT_PAD_D1.5MM]  44.45 -14.99 0 top
VFB1  VFB  [TESTPOINT:TESTPOINT_PAD_D1.5MM]  57.15 -14.99 0 top
VFB2  Connector_TestPoint  [TESTPOINT:TESTPOINT_PAD_D1.5MM]  69.85 -14.99 0 top
VR1  RK1631110U2A  [PTV09A4020FB103]  64.26 15.49 270 top
VR2  100kΩ  [RES-ADJ-SMD_L4.8-W3.5-P2.50-BL-1]  44.7 41.4 90 top
VR3  100kΩ  [RES-ADJ-SMD_L4.8-W3.5-P2.50-BL-1]  44.7 54.1 90 top
VSET  Vset  [TESTPOINT:TESTPOINT_PAD_D1.5MM]  58.42 23.62 0 top

## Footprints (pads in the part's own frame, mm; a bottom-side part is the same pattern mirrored in y, then rotated)
C0603
  rect 0.8x0.9 smd: 1(-0.7,0) 2(0.7,0)
CAP-SMD_BD10.0-L10.3-W10.3-FD
  rect 4.5x1.65 smd: 1(-4.5,0) 2(4.5,0)
CONN-SMD_6P-P2.54_14110613002000
  rect 1.1x6 smd: 1(-6.35,0) 2(-3.81,0) 3(-1.27,0) 4(1.27,0) 5(3.81,0) 6(6.35,0) 7(8.89,0) 8(-8.89,0)
CONN-TH_2P-P5.00_691137710002
  round 2 hole 1.3: 1(-2.5,0) 2(2.5,0)
PTV09A4020FB103
  round 1.8 hole 1.205x1.2: 1(-2.5,-5.6) 2(0,-5.6) 3(2.5,-5.6)
  round 4.46 hole 2.974: 4(-4.4,1.4) 5(4.4,1.4)
PWRM-TH_MEA1DXXXXSC
  rect 1.6x1.6 hole 1: 1(-6.35,0)
  round 1.6 hole 1: 2(-3.81,0) 4(1.27,0) 5(3.81,0) 6(6.35,0)
R0603
  rect 0.806x0.864 smd: 1(-0.753,0) 2(0.753,0)
RES-ADJ-SMD_L4.8-W3.5-P2.50-BL-1
  rect 1.3x1.6 smd: 1(-1.25,-1.45) 3(1.25,-1.45)
  rect 2x1.6 smd: 2(0,1.45)
SMA_L4.3-W2.6-LS5.2-RD
  rect 2x2 smd: 1(-2.2,0) 2(2.2,0)
SOIC-8_L4.9-W3.9-P1.27-LS6.0-BL
  oval 0.588x2.045 smd: 1(-1.905,-2.772) 2(-0.635,-2.772) 3(0.635,-2.772) 4(1.905,-2.772) 5(1.905,2.772) 6(0.635,2.772) 7(-0.635,2.772) 8(-1.905,2.772)
SOIC-8_L5.0-W4.0-P1.27-LS6.0-BL
  oval 0.569x1.95 smd: 1(-1.905,-2.705) 2(-0.635,-2.705) 3(0.635,-2.705) 4(1.905,-2.705) 5(1.905,2.705) 6(0.635,2.705) 7(-0.635,2.705) 8(-1.905,2.705)
SOIC-14_L8.7-W3.9-P1.27-LS6.0-BL
  oval 0.574x2.038 smd: 1(-3.81,-2.769) 2(-2.54,-2.769) 3(-1.27,-2.769) 4(0,-2.769) 5(1.27,-2.769) 6(2.54,-2.769) 7(3.81,-2.769) 8(3.81,2.769) 9(2.54,2.769) 10(1.27,2.769) 11(0,2.769) 12(-1.27,2.769) 13(-2.54,2.769) 14(-3.81,2.769)
TESTPOINT:TESTPOINT_PAD_D1.5MM
  round 1.5 smd: 1(0,0)
TO-220-3_L10.0-W4.5-P2.54-T
  rect 2.5x2 hole 1.3: 1(0,2.54)
  oval 2.5x2 hole 1.3: 2(0,0) 3(0,-2.54)
TO-220-3_L10.2-W4.6-P2.54-L
  rect 2x1.5 hole 1.4x0.8: 1(-2.54,0)
  oval 2x1.5 hole 1.4x0.8: 2(0,0) 3(2.54,0)

## Nets
+12V: C14.2 C15.2 U5.6 U6.1
+12VREG: +12VREG.1 C1.1 C2.1 C3.1 C5.2 C8.1 RPULL.1 U1.8 U2.8 U3.8 U4.8 U6.3 U8.8 U9.8 U9.9 VR1.1
-12V: C16.2 C17.2 U5.4 U7.2
-12VREG: -12VREG.1 C6.2 C19.2 C20.2 C21.2 U1.4 U2.4 U3.4 U7.3 U8.4
GND: C1.2 C2.2 C3.2 C5.1 C6.1 C8.2 C9.1 C10.1 C14.1 C15.1 C16.1 C17.1 C18.1 C19.1 C20.1 C21.1 CBULK.2 CN1.2 GND1.1 GND2.1 GND3.1 MOTOR.3 MOTOR.6 Q1PULL.2 U2.3 U2.5 U3.3 U3.5 U4.1 U4.4 U5.2 U5.5 U6.2 U7.1 U8.2 U8.5 U9.12 VR1.3
VCC: C9.2 C10.2 C18.2 CBULK.1 CN1.1 D1.1 MOTOR.1 MOTOR.4 U5.1 VCC.1
C7_2: C7.2 RBLEED.1 VR3.3
ENCOUTA: ENCOUTA.1 MOTOR.5 U9.1
GATE: Q1.1 Q1.3 Q1PULL.1 RGATE.2
MOTORN: D1.2 MOTOR.2 Q1.2
PIOUT: PIOUT.1 R3.1 R7.2 R9.2 U3.6
PWMOUT: PWMOUT.1 RGATE.1 RPULL.2 U4.7
R2_2: R2.2 R6.2
R5_2: R5.2 VR2.3
SUMOUT: R9.1 SUMOUT.1 U3.7 U4.2
TP1_1: TP1.1
U1_1: R4.1 U1.1 U1.2
U1_3: U1.3 VR1.2 VSET.1
U1_5: R4.2 U1.5
U1_6: R1.1 R14.2 U1.6
U2_1: R3.2 R5.1 U2.1
U2_2: U2.2 VR2.2
U2_6: U2.6 VR3.2
U2_7: C7.1 R7.1 RBLEED.2 U2.7
U8_1: R2.1 R8.2 U8.1
U8_3: U8.3
U8_6: C4.1 R8.1 U8.6
U8_7: C4.2 R6.1 U8.7
U9_2: U9.2
U9_3: U9.3
U9_4: U9.4
U9_5: U9.5
U9_10: U9.10
VERROR: R1.2 U1.7 VERROR.1 VR2.1 VR3.1
VFB: R14.1 U9.11 VFB1.1 VFB2.1
VTRI: U4.3

Pads without a net: MOTOR 7 8; U3 1 2; U4 5 6; U9 6 7 13 14; VR1 4 5

## Via types
v1: diameter 0.62, hole 0.31, Top Layer to Bottom Layer, 111 vias

## Routing (per net, layer and track width the routed paths; a pad name or vN(x,y) marks a point on that pad's centre or on a via; arc(x,y) is an arc through that point)
+12V: length 9.3
  Top Layer w0.762: U5.6 48.96,8.05 C15.2 C14.2 50.29,11.75 U6.1
+12VREG: length 72.8
  Top Layer w0.508: 49.78,64.67 49.93,64.52 C3.1 51.73,64.41 U3.8 ; U1.8 51.73,39.01 C1.1 49.78,39.12 ; 49.78,72.9 49.78,19.56 U6.3 57.61,19.05 VR1.1 ; U2.8 51.73,51.71 C2.1 49.78,51.82
-12V: length 12.5
  Top Layer w0.762: U7.2 37.34,13.46 37.85,12.95 40.89,12.95 42.16,11.68 42.16,10.22 C16.2 C17.2 42.1,6.27 U5.4
-12VREG: length 74.2
  Top Layer w0.508: C19.2 48.26,32.51 ; U7.3 34.8,15.49 48.26,28.96 48.26,72.9 ; 46.17,32.51 46.18,33.91 ; 46.17,57.91 46.18,59.32 ; C20.2 48.26,45.21 ; 46.17,45.21 46.18,46.62 ; C21.2 48.26,57.91
GND: length 41.6
  Top Layer w0.508: 45.47,15.24 46.74,16.51 U6.2 ; U7.1 41.91,14.73 43.18,13.46
  Top Layer w0.762: C16.1 40.19,9.65 v1(38.86,9.65) ; C15.1 46.29,9.65 v1(45.21,9.65) ; v1(38.1,8.13) 38.1,7.35 U5.2 ; v1(21.34,23.37) 19.77,23.37 ; C14.1 46.8,11.18 v1(45.21,11.18) ; C17.1 40.45,8.13 v1(38.86,8.13) ; v1(21.34,21.08) C9.1 ; U5.5 v1(44.45,8.89)
  Top Layer w1.016: 36.83,6.08 36.83,6.54 C18.1
  Top Layer w1.27: v1(25.4,7.37) 22.31,7.37 CN1.2
  Top Layer w1.524: CBULK.2 25.33,11.94 v1(25.4,11.94)
  vias: v1(24.64,12.7) v1(24.64,11.94) v1(24.64,11.18) v1(24.64,10.41) v1(24.64,9.65) v1(24.64,8.89) v1(24.64,8.13) v1(24.64,7.37) v1(24.64,6.6) v1(24.64,5.84) v1(25.4,12.7) v1(25.4,11.18) v1(25.4,10.41) v1(25.4,9.65) v1(25.4,8.89) v1(25.4,8.13) v1(25.4,6.6) v1(25.4,5.84) v1(26.16,12.7) v1(26.16,11.94) v1(26.16,11.18) v1(26.16,10.41) v1(26.16,9.65) v1(26.16,8.89) v1(26.16,8.13) v1(26.16,7.37) v1(26.16,6.6) v1(26.16,5.84) v1(26.92,12.7) v1(26.92,11.94) v1(26.92,11.18) v1(26.92,10.41) v1(26.92,9.65) v1(26.92,8.89) v1(26.92,8.13) v1(26.92,7.37) v1(26.92,6.6) v1(26.92,5.84) v1(27.69,12.7) v1(27.69,11.94) v1(27.69,11.18) v1(27.69,10.41) v1(27.69,9.65) v1(27.69,8.89) v1(27.69,8.13) v1(27.69,7.37) v1(27.69,6.6) v1(27.69,5.84) v1(28.45,12.7) v1(28.45,11.94) v1(28.45,11.18) v1(28.45,10.41) v1(28.45,9.65) v1(28.45,8.89) v1(28.45,8.13) v1(28.45,7.37) v1(28.45,6.6) v1(28.45,5.84) v1(29.21,12.7) v1(29.21,11.94) v1(29.21,11.18) v1(29.21,10.41) v1(29.21,9.65) v1(29.21,8.89) v1(29.21,8.13) v1(29.21,7.37) v1(29.21,6.6) v1(29.21,5.84) v1(37.34,9.65) v1(37.34,8.89) v1(37.34,8.13) v1(38.1,9.65) v1(38.1,8.89) v1(38.86,8.89) v1(43.69,14.99) v1(43.69,14.22) v1(43.69,13.46) v1(43.69,12.7) v1(43.69,11.94) v1(43.69,11.18) v1(43.69,10.41) v1(43.69,9.65) v1(43.69,8.89) v1(44.45,14.99) v1(44.45,14.22) v1(44.45,13.46) v1(44.45,12.7) v1(44.45,11.94) v1(44.45,11.18) v1(44.45,10.41) v1(44.45,9.65) v1(45.21,14.99) v1(45.21,14.22) v1(45.21,13.46) v1(45.21,12.7) v1(45.21,11.94) v1(45.21,10.41) v1(45.21,8.89)
VCC: length 97.4
  Top Layer w1.016: D1.1 13.04,43.18 MOTOR.1 ; 7.24,43.18 4.83,43.18 3.05,41.4 3.05,34.29
  Top Layer w1.27: C9.2 C10.2 ; CN1.1 18.84,1.78 29.72,1.78 30.99,3.05 30.99,7.37 32.77,9.14 C18.2 32.83,7.54 U5.1
  Top Layer w1.524: CN1.1 13.53,7.08 CBULK.1 18.1,19.29 C9.2 ; C10.2 16.83,24.64 4.06,24.64 3.05,25.65 3.05,34.29 4.32,35.56 MOTOR.4
MOTORN: length 11.8
  Top Layer w1.524: MOTOR.2 13.04,40.64 D1.2 16.28,42.03 Q1.2
U1_3: length 41.8
  Top Layer w0.508: VR1.2 v1(54.61,15.49) ; U1.3 43.31,35.18 v1(43.18,35.05) ; v1(56.64,21.84) VSET.1
  Inner2 w0.508: v1(54.61,15.49) 54.61,22.1 48.01,28.7 41.91,28.7 41.4,29.21 41.4,33.78 42.67,35.05 v1(43.18,35.05) ; v1(56.64,21.84) 54.86,20.07

## Copper pours and planes (outline as drawn; the poured copper is in the pictures)
GND on Top Layer: 24.13,13.46 29.72,13.46 29.72,5.08 24.13,5.08
GND on Top Layer: 36.83,10.16 39.37,10.16 39.37,7.62 36.83,7.62
GND on Top Layer: 43.18,15.49 45.72,15.49 45.72,8.38 43.18,8.38
GND on Inner1: 40.64,4.32 48.26,4.32 48.26,2.54 40.64,2.54
GND on Inner1: -29.46,92.2 82.55,91.95 83.57,49.78 82.55,8.89 76.45,-1.78 -27.18,-3.05

## Text on the board
Top Silkscreen Layer: +12V | GND

# Board PCB2
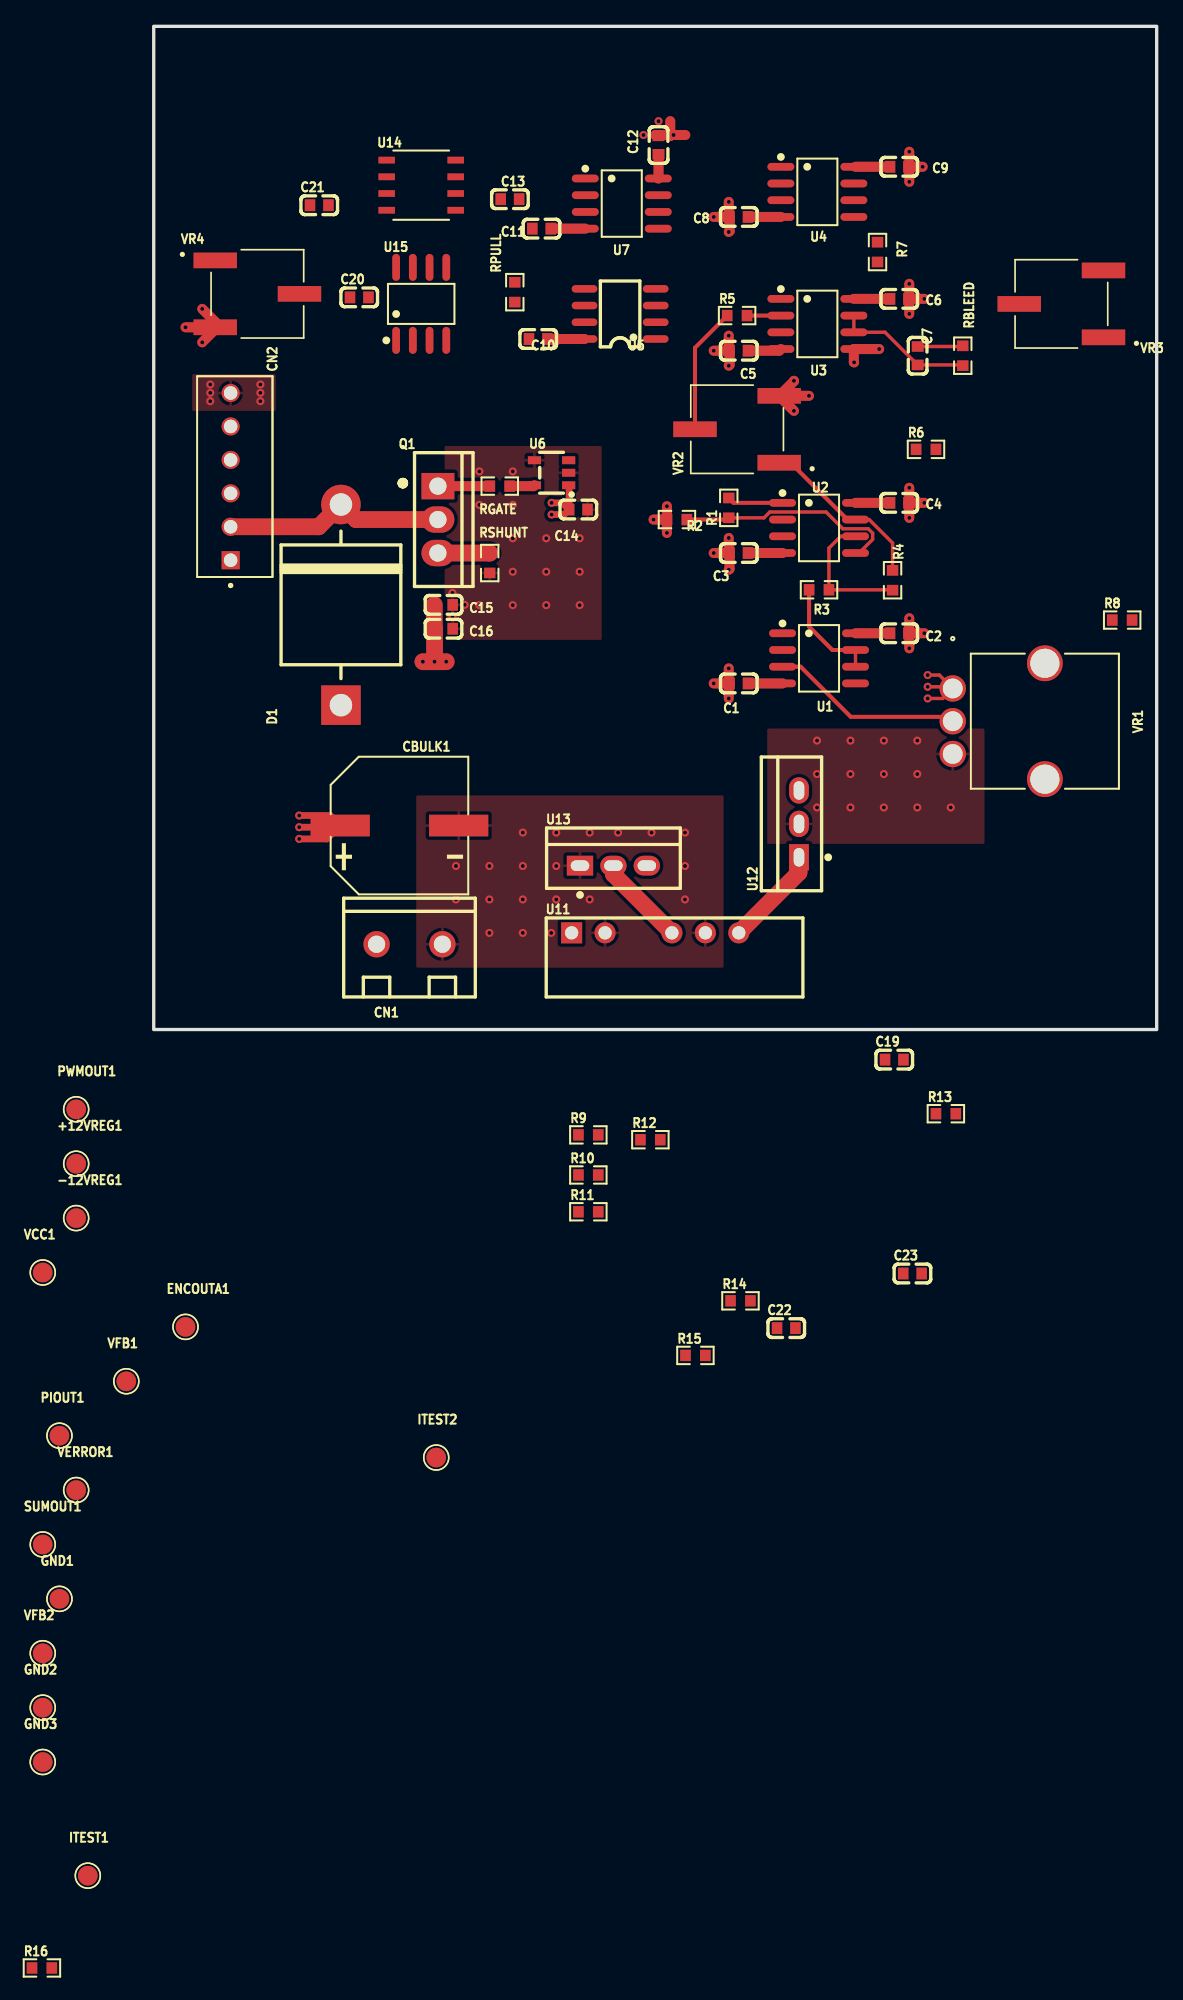
[diagram p4: board, top side]
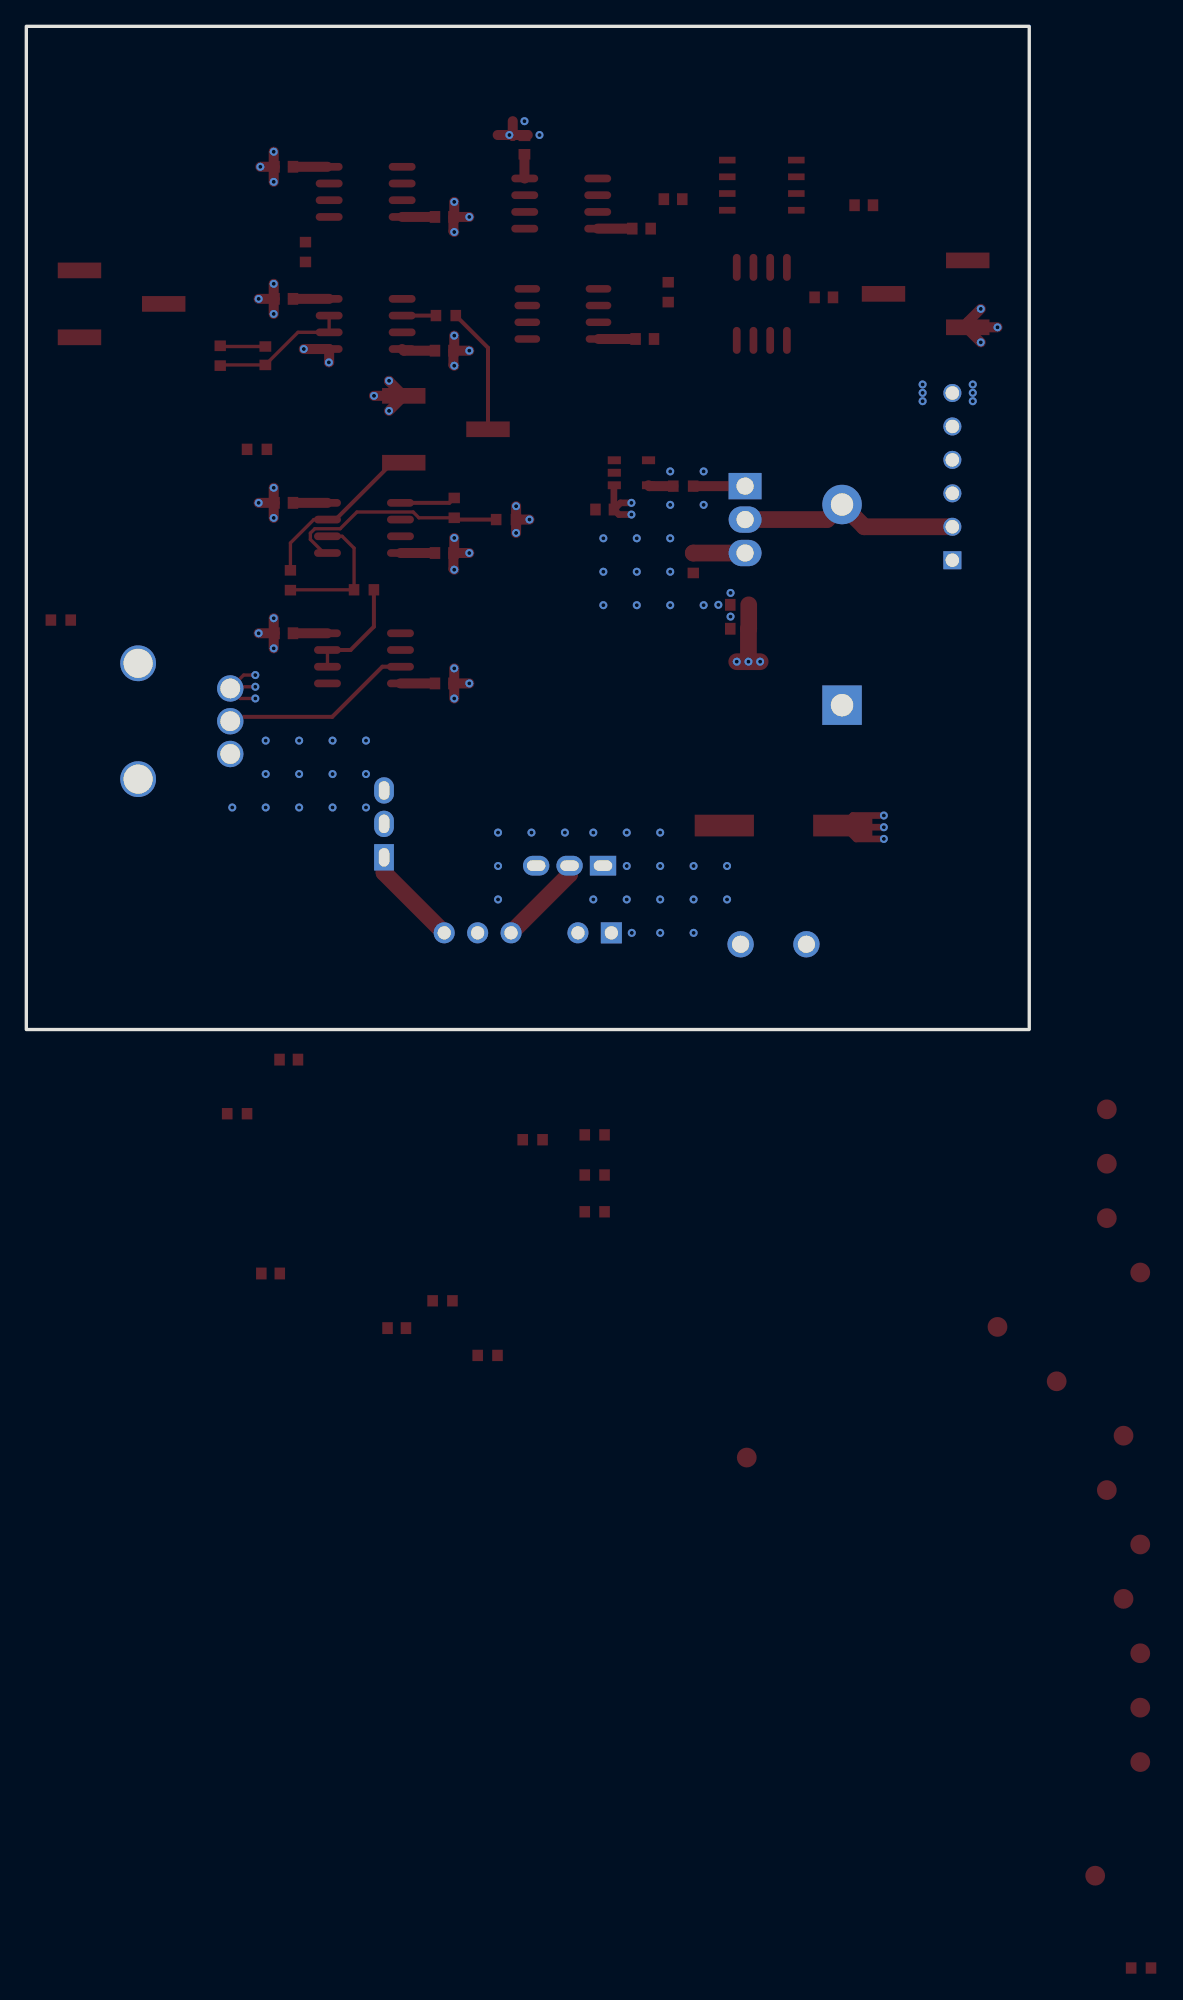
[diagram p5: board, bottom side, seen from below]

Outline 76.2 x 76.2 mm; copper layers: Top Layer, Inner1, Inner2, Bottom Layer. Coordinates in mm from the lower left corner of the outline.
Outline path: rectangle 0,76.2 76.2,0
Stack: Top Layer 0.035mm Outer layer thickness 1oz / Dielectric1 0.2104mm 7628 RC49% 8.6mil / Inner1 0.0152mm Inner layer thickness / Dielectric2 1.065mm 1.1mm H/HOZ Copper / Inner2 0.0152mm Inner layer thickness / Dielectric3 0.2104mm 7628 RC49% 8.6mil / Bottom Layer 0.035mm Outer layer thickness 1oz

## Design rules (mm)
template: Custom Config
spacing copperThickness1oz (default): track to track 0.102, other pairs 0.152 to 0.3
spacing copperThickness2oz: track to track 0.203, other pairs 0.152 to 0.3
track width copperThickness1oz (default): min 0.127, default 0.254, max 2.54
track width copperThickness2oz: min 0.203, default 0.254, max 2.54
differential pair differentialPair (default): width min 0.127, default 0.254, max 2.54; gap min 0.152, default 0.152
via viaSize (default): diameter min 0.5, default 0.61, max 10; hole min 0.3, default 0.305, max 6.3
pour e139 uses copperRegion

## Placement (name value [footprint] x y rotation side)
+12VREG1  Connector_TestPoint  [TESTPOINT:TESTPOINT_PAD_D1.5MM]  -5.89 -10.19 0 top
-12VREG1  Connector_TestPoint  [TESTPOINT:TESTPOINT_PAD_D1.5MM]  -5.89 -14.32 0 top
C1  0.1uF  [C0603]  44.45 26.29 180 top
C2  0.1uF  [C0603]  56.64 30.1 0 top
C3  0.1uF  [C0603]  44.45 36.19 180 top
C4  0.1uF  [C0603]  56.64 40 0 top
C5  0.1uF  [C0603]  44.45 51.56 180 top
C6  0.1uF  [C0603]  56.64 55.5 0 top
C7  0.1uF  [C0603]  58.04 51.18 270 top
C8  0.1uF  [C0603]  44.45 61.72 180 top
C9  0.1uF  [C0603]  56.64 65.53 0 top
C10  0.1uF  [C0603]  29.21 52.45 180 top
C11  0.1uF  [C0603]  29.46 60.83 180 top
C12  0.1uF  [C0603]  38.35 67.18 90 top
C13  470p  [C0603]  27.06 63.07 0 top
C14  1uF  [C0603]  32.26 39.5 0 top
C15  4.7uF  [C0603]  22.02 32.26 180 top
C16  100nF  [C0603]  22.02 30.44 180 top
C19  1u  [C0603]  56.26 -2.29 0 top
C20  1uF  [C0603]  15.61 55.61 0 top
C21  10nF  [C0603]  12.57 62.61 0 top
C22  0.1uF  [C0603]  48.06 -22.68 0 top
C23  0.1uF  [C0603]  57.64 -18.53 0 top
CBULK1  470uF  [CAP-SMD_BD10.0-L10.3-W10.3-FD]  18.67 15.49 0 top
CN1  Power  [CONN-TH_2P-P5.00_691137710002]  19.43 6.48 0 top
CN2  640456-6  [TE_640456-6]  5.84 35.65 270 top
D1  -  [R-6_BD9.0-L9.0-W9.0-P15.00-D1.7-FD]  14.22 32.26 90 top
ENCOUTA1  ENCOUTA  [TESTPOINT:TESTPOINT_PAD_D1.5MM]  2.41 -22.59 0 top
GND1  Connector_TestPoint  [TESTPOINT:TESTPOINT_PAD_D1.5MM]  -7.16 -43.25 0 top
GND2  Connector_TestPoint  [TESTPOINT:TESTPOINT_PAD_D1.5MM]  -8.43 -51.51 0 top
GND3  Connector_TestPoint  [TESTPOINT:TESTPOINT_PAD_D1.5MM]  -8.43 -55.64 0 top
ITEST1  Connector_TestPoint  [TESTPOINT:TESTPOINT_PAD_D1.5MM]  -5.01 -64.27 0 top
ITEST2  Connector_TestPoint  [TESTPOINT:TESTPOINT_PAD_D1.5MM]  21.46 -32.51 0 top
PIOUT1  Connector_TestPoint  [TESTPOINT:TESTPOINT_PAD_D1.5MM]  -7.16 -30.85 0 top
PWMOUT1  Connector_TestPoint  [TESTPOINT:TESTPOINT_PAD_D1.5MM]  -5.89 -6.06 0 top
Q1  IRLZ44NPBF  [TO-220-3_L10.0-W4.5-P2.54-T]  21.59 38.73 0 top
R1  100k  [R0603]  43.69 39.62 90 top
R2  100k  [R0603]  39.75 38.73 180 top
R3  100k  [R0603]  50.55 33.4 0 top
R4  100k  [R0603]  56.13 34.13 270 top
R5  1k  [R0603]  44.32 54.23 0 top
R6  100k  [R0603]  58.67 44.07 0 top
R7  100k  [R0603]  54.99 59.06 90 top
R8  100k  [R0603]  73.58 31.1 0 top
R9  10k  [R0603]  33.02 -8 0 top
R10  75k  [R0603]  33.02 -11.05 0 top
R11  63k  [R0603]  33.02 -13.84 0 top
R12  100k  [R0603]  37.73 -8.37 0 top
R13  470  [R0603]  60.18 -6.39 0 top
R14  82k  [R0603]  44.58 -20.61 0 top
R15  100k  [R0603]  41.16 -24.75 0 top
R16  10k  [R0603]  -8.5 -71.28 0 top
RBLEED  100k  [R0603]  61.47 51.18 90 top
RGATE  10  [R0603]  26.29 41.28 180 top
RPULL  1.2k  [R0603]  27.43 56.01 270 top
RSHUNT  10  [R0603]  25.53 35.43 270 top
SUMOUT1  Connector_TestPoint  [TESTPOINT:TESTPOINT_PAD_D1.5MM]  -8.43 -39.11 0 top
U1  InputBuffers  [SOIC-8_L4.9-W3.9-P1.27-LS6.0-BL]  50.55 28.19 270 top
U2  Setpoint/Error  [SOIC-8_L4.9-W3.9-P1.27-LS6.0-BL]  50.55 38.1 270 top
U3  P/I  [SOIC-8_L4.9-W3.9-P1.27-LS6.0-BL]  50.42 53.59 270 top
U4  Sum  [SOIC-8_L4.9-W3.9-P1.27-LS6.0-BL]  50.42 63.63 270 top
U5  Comp  [SOIC-8_L5.0-W4.0-P1.27-LS6.0-BL]  35.43 54.36 90 top
U6  -  [SOT-23-5_L3.0-W1.7-P0.95-LS2.8-BR]  30.23 42.29 0 top
U7  WaveGen  [SOIC-8_L4.9-W3.9-P1.27-LS6.0-BL]  35.56 62.74 270 top
U11  MEA1D1212SC  [PWRM-TH_MEA1DXXXXSC]  38.1 7.34 0 top
U12  +12Reg  [TO-220-3_L10.2-W4.6-P2.54-L]  49.02 15.62 90 top
U13  -12Reg  [TO-220-3_L10.2-W4.6-P2.54-L]  34.93 12.45 0 top
U14  LM2917M-8_NOPB  [M08A_TEX]  20.32 64.14 0 top
U15  FeedbackBuffer  [SOIC-8_L4.9-W3.9-P1.27-LS6.0-BL]  20.32 55.12 0 top
VCC1  Connector_TestPoint  [TESTPOINT:TESTPOINT_PAD_D1.5MM]  -8.43 -18.46 0 top
VERROR1  Connector_TestPoint  [TESTPOINT:TESTPOINT_PAD_D1.5MM]  -5.89 -34.98 0 top
VFB1  VFB  [TESTPOINT:TESTPOINT_PAD_D1.5MM]  -2.08 -26.72 0 top
VFB2  Connector_TestPoint  [TESTPOINT:TESTPOINT_PAD_D1.5MM]  -8.43 -47.38 0 top
VR1  PTV09A-4015F-B104  [PTV09A-4015F-B104_BRN]  60.71 25.91 270 top
VR2  3361P-1-104GLF  [TRIM_3361P-1-104GLF]  44.32 45.59 180 top
VR3  3361P-1-104GLF  [TRIM_3361P-1-104GLF]  68.96 55.12 180 top
VR4  3361P-1-104GLF  [TRIM_3361P-1-104GLF]  7.87 55.88 0 top

## Footprints (pads in the part's own frame, mm; a bottom-side part is the same pattern mirrored in y, then rotated)
C0603
  rect 0.8x0.9 smd: 1(-0.7,0) 2(0.7,0)
CAP-SMD_BD10.0-L10.3-W10.3-FD
  rect 4.5x1.65 smd: 1(-4.5,0) 2(4.5,0)
CONN-TH_2P-P5.00_691137710002
  round 2 hole 1.3: 1(-2.5,0) 2(2.5,0)
M08A_TEX
  rect 1.258x0.508 smd: 1(-2.623,1.905) 2(-2.623,0.635) 3(-2.623,-0.635) 4(-2.623,-1.905) 5(2.623,-1.905) 6(2.623,-0.635) 7(2.623,0.635) 8(2.623,1.905)
PTV09A-4015F-B104_BRN
  round 2.006 hole 1.498: 1(0,0) 2(2.489,0) 3(4.979,0)
  round 2.718 hole 2.21: 4(-1.911,7) 5(6.889,7)
PWRM-TH_MEA1DXXXXSC
  rect 1.6x1.6 hole 1: 1(-6.35,0)
  round 1.6 hole 1: 2(-3.81,0) 4(1.27,0) 5(3.81,0) 6(6.35,0)
R0603
  rect 0.806x0.864 smd: 1(-0.753,0) 2(0.753,0)
R-6_BD9.0-L9.0-W9.0-P15.00-D1.7-FD
  rect 2.999x2.999 hole 1.7: 1(-7.62,0)
  round 2.999 hole 1.7: 2(7.62,0)
SOIC-8_L4.9-W3.9-P1.27-LS6.0-BL
  oval 0.588x2.045 smd: 1(-1.905,-2.772) 2(-0.635,-2.772) 3(0.635,-2.772) 4(1.905,-2.772) 5(1.905,2.772) 6(0.635,2.772) 7(-0.635,2.772) 8(-1.905,2.772)
SOIC-8_L5.0-W4.0-P1.27-LS6.0-BL
  oval 0.569x1.95 smd: 1(-1.905,-2.705) 2(-0.635,-2.705) 3(0.635,-2.705) 4(1.905,-2.705) 5(1.905,2.705) 6(0.635,2.705) 7(-0.635,2.705) 8(-1.905,2.705)
SOT-23-5_L3.0-W1.7-P0.95-LS2.8-BR
  rect 1x0.6 smd: 1(1.3,-0.95) 2(1.3,0) 3(1.3,0.95) 4(-1.3,0.95) 5(-1.3,-0.95)
TE_640456-6
  rect 1.37x1.37 hole 1.02: 1(0,0)
  round 1.37 hole 1.02: 2(-2.54,0) 3(-5.08,0) 4(-7.62,0) 5(-10.16,0) 6(-12.7,0)
TESTPOINT:TESTPOINT_PAD_D1.5MM
  round 1.5 smd: 1(0,0)
TO-220-3_L10.0-W4.5-P2.54-T
  rect 2.5x2 hole 1.3: 1(0,2.54)
  oval 2.5x2 hole 1.3: 2(0,0) 3(0,-2.54)
TO-220-3_L10.2-W4.6-P2.54-L
  rect 2x1.5 hole 1.4x0.8: 1(-2.54,0)
  oval 2x1.5 hole 1.4x0.8: 2(0,0) 3(2.54,0)
TRIM_3361P-1-104GLF
  rect 3.3x1.19 smd: 1(-3.2,2.54) 2(3.2,0) 3(-3.2,-2.54)

## Nets
As in the schematic.

Pads without a net: U5 5 6; VR1 4 5; VR4 1

## Via types
v1: diameter 0.61, hole 0.305, Top Layer to Bottom Layer, 105 vias

## Routing (per net, layer and track width the routed paths; a pad name or vN(x,y) marks a point on that pad's centre or on a via; arc(x,y) is an arc through that point)
+12V: length 7.6
  Top Layer w1.27: U11.6 49.02,11.92 U12.1
+12VREG: length 26.3
  Top Layer w0.254: v1(58.8,26.03) 60.58,26.03 59.69,26.92 v1(58.8,26.92) ; VR1.1 59.94,25.15 v1(58.8,25.15)
  Top Layer w0.508: C14.1 31.56,41.31 U6.1 ; C14.1 31.05,40 v1(30.23,40) ; C14.1 31.18,39.12 v1(30.23,39.12)
  Top Layer w0.762: C9.1 53.32,65.53 ; C2.1 U1.8 ; U7.8 38.35,64.66 C12.1 ; C4.1 U2.8 ; C10.1 U5.8 ; C6.1 U3.8
-12V: length 6.9
  Top Layer w1.27: U13.2 34.93,11.79 U11.4
-12VREG: length 12.9
  Top Layer w0.762: C11.1 U7.4 ; U3.4 47.52,51.56 C5.1 ; C3.1 U2.4 ; C8.1 U4.4 ; C1.1 U1.4
GND: length 48.9
  Top Layer w0.762: VR4.3 4.67,53.75 v1(3.68,54.74) ; VR4.3 v1(2.41,53.34) ; VR4.3 4.67,53.19 v1(3.68,52.2) ; v1(57.4,31.24) 57.4,30.16 C2.2 ; C9.2 57.4,65.47 v1(57.4,64.39) ; C9.2 57.4,65.59 v1(57.4,66.67) ; C9.2 v1(58.42,65.53) ; v1(37.97,38.73) R2.2 ; R2.2 38.99,38.74 v1(38.99,39.75) ; R2.2 38.99,38.73 v1(38.99,37.72) ; v1(49.78,48.13) 47.52,48.13 ; 47.52,48.13 48.64,49.25 v1(48.64,49.28) ; 47.52,48.13 47.52,48.11 v1(48.64,46.99) ; C1.2 43.69,26.23 v1(43.69,25.15) ; C1.2 43.69,26.35 v1(43.69,27.43) ; C1.2 v1(42.54,26.29) ; C6.2 57.4,55.56 v1(57.4,56.64) ; C6.2 v1(58.55,55.5) ; C6.2 57.4,55.44 v1(57.4,54.36) ; v1(42.54,61.72) C8.2 ; C8.2 43.69,61.78 v1(43.69,62.86) ; C8.2 43.75,60.64 v1(43.69,60.58) ; v1(43.69,50.42) 43.75,50.48 C5.2 ; C2.2 57.4,30.04 v1(57.4,28.96) ; C2.2 v1(58.55,30.1) ; v1(43.69,34.92) 43.75,34.99 C3.2 ; v1(55.12,51.69) U3.5 53.19,50.69 v1(53.21,50.67) ; C4.2 57.4,40.07 v1(57.4,41.15) ; C4.2 57.4,39.94 v1(57.4,38.86) ; C4.2 v1(58.55,40) ; 39.24,69 39.24,67.88 ; 39.24,67.88 39.31,67.94 40.39,67.94 ; 39.24,67.88 39.18,67.94 38.1,67.94 ; C3.2 v1(42.54,36.19) ; C3.2 43.69,36.26 v1(43.69,37.34) ; v1(43.69,52.7) 43.69,51.62 C5.2 ; v1(42.54,51.56) C5.2
  vias: v1(4.29,49) v1(4.29,48.36) v1(4.29,47.73) v1(8.1,49) v1(8.1,48.36) v1(8.1,47.73) v1(22.7,33.17) v1(22.7,31.37) v1(22.96,12.42) v1(22.96,9.88) v1(23.62,32.26) v1(24.74,42.39) v1(24.74,39.85) v1(24.74,32.23) v1(25.5,12.42) v1(25.5,9.88) v1(25.5,7.34) v1(27.28,42.39) v1(27.28,39.85) v1(27.28,37.31) v1(27.28,34.77) v1(27.28,32.23) v1(28.04,14.96) v1(28.04,12.42) v1(28.04,9.88) v1(28.04,7.34) v1(29.82,37.31) v1(29.82,34.77) v1(29.82,32.23) v1(30.2,7.34) v1(30.58,14.96) v1(30.58,12.42) v1(30.58,9.88) v1(32.36,37.31) v1(32.36,34.77) v1(32.36,32.23) v1(33.12,14.96) v1(33.12,9.88) v1(35.28,14.96) v1(37.21,67.94) v1(37.82,14.96) v1(38.35,69) v1(39.5,67.94) v1(40.36,14.96) v1(40.36,12.42) v1(40.36,9.88) v1(50.39,21.95) v1(50.39,19.41) v1(50.39,16.87) v1(52.93,21.95) v1(52.93,19.41) v1(52.93,16.87) v1(55.47,21.95) v1(55.47,19.41) v1(55.47,16.87) v1(58.01,21.95) v1(58.01,19.41) v1(58.01,16.87) v1(60.55,16.87)
VCC: length 34.6
  Top Layer w0.254: 14.04,15.37 14.17,15.49
  Top Layer w0.508: v1(11.05,14.48) 13.15,14.48 14.04,15.37 v1(11.05,15.37) ; 14.17,15.49 13.41,16.26 v1(11.05,16.26)
  Top Layer w1.27: v1(21.34,27.94) 21.34,30.42 C16.2 C15.2 ; v1(21.34,27.94) v1(20.45,27.94) ; v1(21.34,27.94) v1(22.22,27.94)
  Inner2 w1.27: CN1.1 16.93,6.44 20.32,3.05 28.22,3.05 31.75,6.58 U11.1
MOTORN: length 16.9
  Top Layer w1.27: CN2.2 12.53,38.19 D1.2 15.37,38.73 Q1.2
PIOUT: length 2.6
  Top Layer w0.305: R5.2 U3.2
VERROR: length 13.2
  Top Layer w0.254: R4.1 56.13,36.96 54.36,38.73 U2.7
  Top Layer w0.305: U2.7 52.71,38.73 48.39,43.05 VR2.1
VFBOUT: length 10.4
  Top Layer w0.254: R4.2 56.1,33.4 R3.2 51.3,36.57 52.2,37.47 U2.6
$1N167: length 14.6
  Top Layer w0.305: U1.3 49.15,27.56 52.96,23.75 60.38,23.75 VR1.2
$1N384: length 8.3
  Top Layer w0.254: U1.6 53.32,28.83
  Top Layer w0.305: 53.32,28.83 51.56,28.83 49.79,30.6 R3.1
$1N456: length 4.2
  Top Layer w0.305: U2.1 44.06,40 R1.2
$1N582: length 17.2
  Top Layer w0.254: R1.1 46.37,38.87 46.81,39.31 51.08,39.31 52.35,38.04 54.28,38.04 54.62,37.7 54.62,37.23 53.59,36.19 U2.5
  Top Layer w0.305: R1.1 43.55,38.73 R2.1
$1N1340: length 10.6
  Top Layer w0.254: U3.7 53.19,52.96 55.56,52.96 C7.2 61.41,50.48 RBLEED.1
$1N1453: length 3.5
  Top Layer w0.254: RBLEED.2 61.41,51.88 C7.1
$1N2753: length 1.9
  Top Layer w0.762: U6.5 28.86,41.28 RGATE.1
$1N2757: length 3.9
  Top Layer w0.762: Q1.1 RGATE.2
$1N8807: length 3.9
  Top Layer w1.27: RSHUNT.1 25.52,36.19 Q1.3
$1N14002: length 9.6
  Top Layer w0.305: R5.1 41.12,51.78 VR2.2

## Copper pours and planes (outline as drawn; the poured copper is in the pictures)
+12VREG on Inner2: 47.24,74.47 63.75,74.47 63.75,14.48 47.24,14.48
+12VREG on Inner2: 2.41,69.34 25.53,69.34 25.53,50.17 2.41,50.17
+12VREG on Inner2: 10.51,74.42 47.5,74.42 47.5,68.5 10.51,68.5
+12VREG on Inner2: 29.71,45.4 32.89,45.4 32.89,38.35 29.71,38.35
+12VREG on Inner2: 22.61,53.21 32.89,53.21 32.89,44.83 22.61,44.83
-12VREG on Inner2: 45.72,67.06 28.45,67.06 28.45,54.68 34.08,54.68 34.08,11.18 45.72,11.18
GND on Top Layer: 2.92,49.78 9.27,49.78 9.27,46.99 2.92,46.99
GND on Top Layer: 19.94,17.78 43.3,17.78 43.3,4.7 19.94,4.7
GND on Top Layer: 46.61,22.86 63.12,22.86 63.12,14.1 46.61,14.1
GND on Top Layer: 22.1,44.32 34.04,44.32 34.04,29.59 22.1,29.59
GND on Inner1: -9.14,85.34 75.69,85.34 75.69,2.41 -9.14,2.41
VCC on Inner2: 2.03,37.21 18.67,37.21 18.67,1.97 2.03,1.97
VCC on Inner2: 2.03,44.83 7.75,44.83 7.75,41.91 2.03,41.91
VCC on Inner2: 2.03,42.55 3.81,42.55 3.81,35.18 2.03,35.18
VCC on Inner2: 16.89,29.21 27.1,29.21 27.1,23.11 16.89,23.11
